# EAGLE design IMU_NoPilot (EAGLE 6.2)
AUTHOR: Kjell H Andersen; PROJECT_NAME: NoPilot; REVISION: 0.1

## Sheet 1 of 8: STM32 Power and Reset
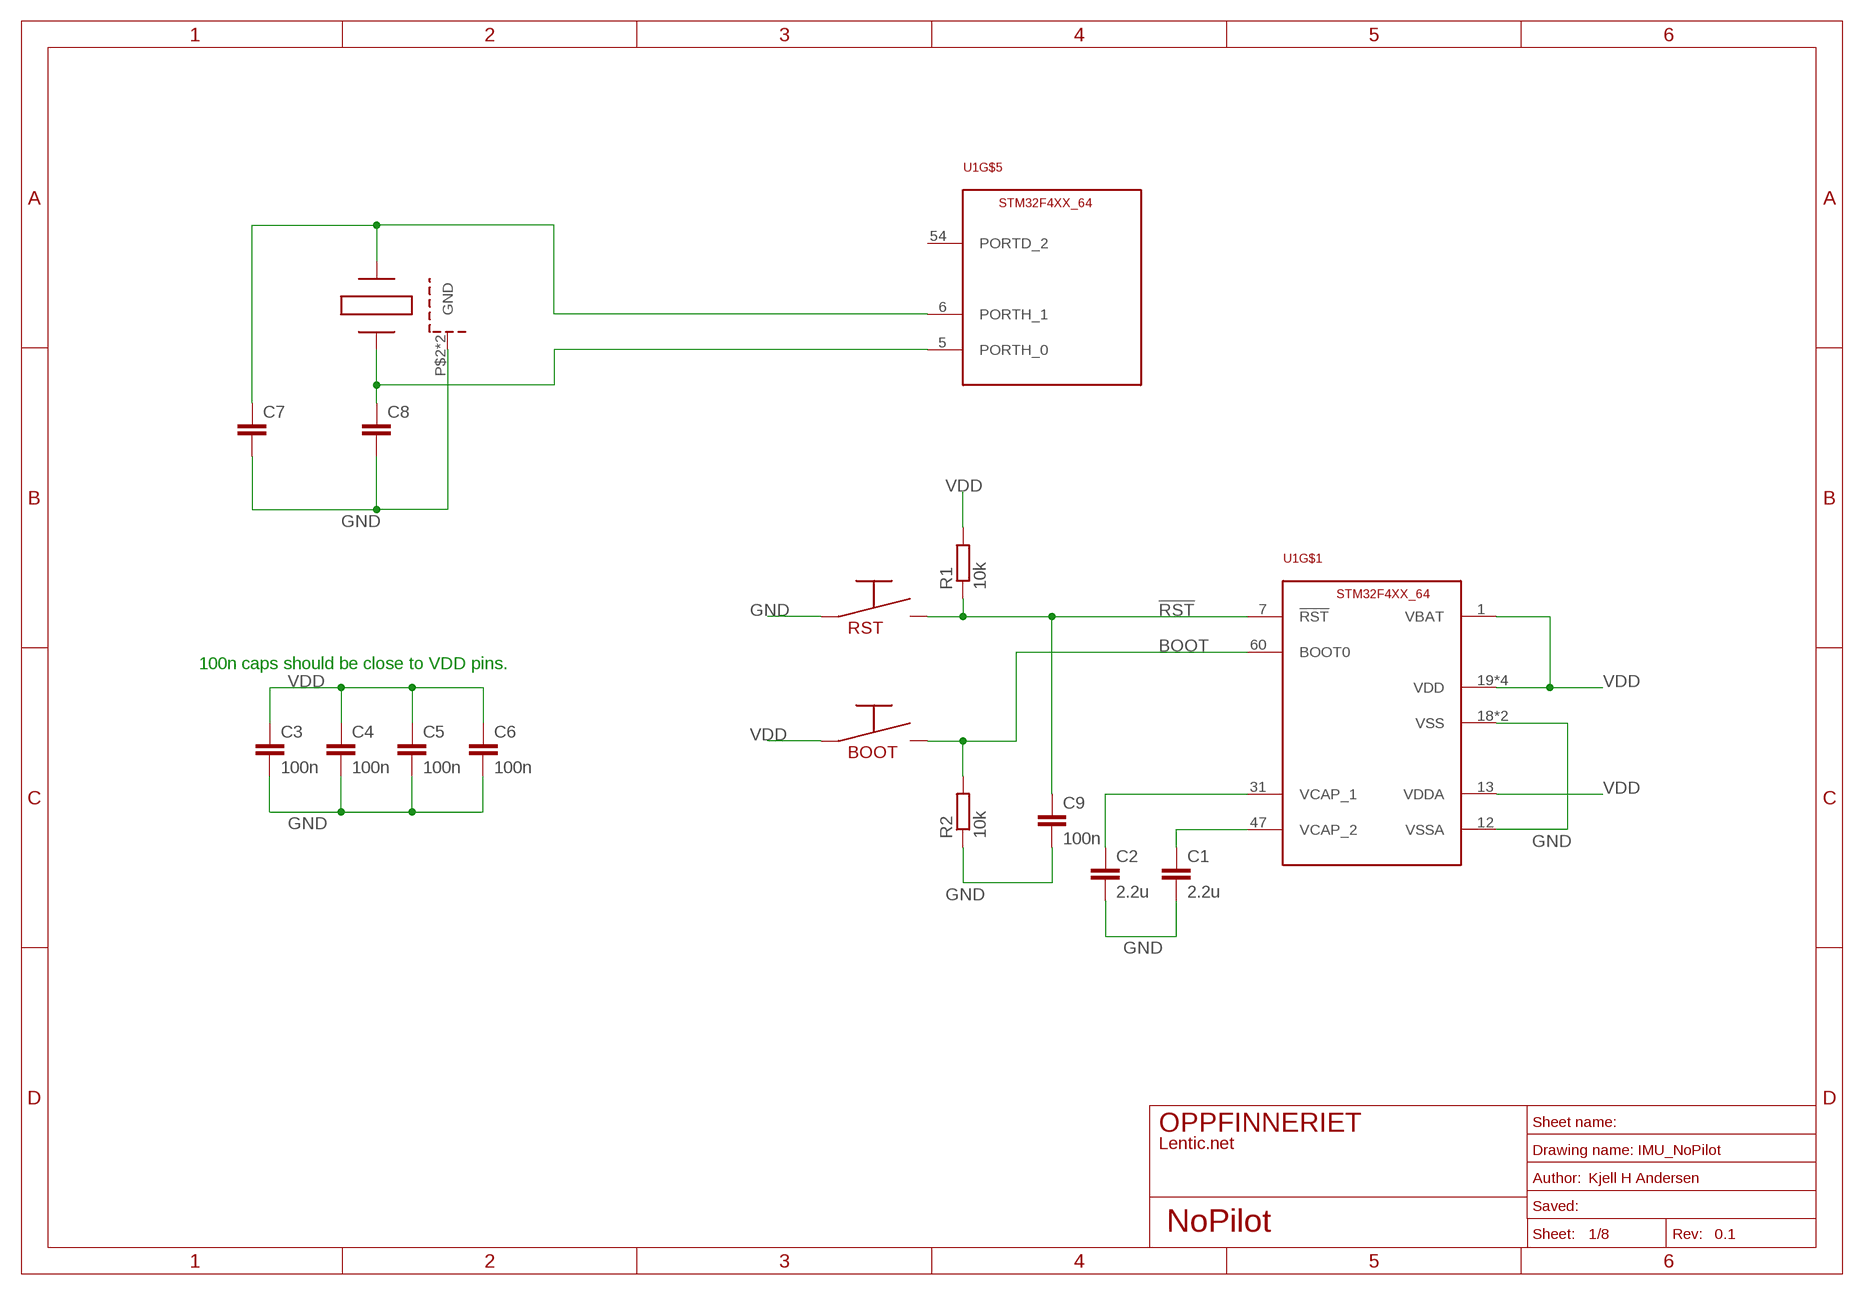
[diagram p0: schematic, sheet 1]
U$2 (A4_L): SHEET_NAME: stm32 Pwr/Rst

### Parts
BOOT  OMRON_B3FS_1000  [OMROM_B3FS-1XXX]
C1  2.2u  C-EUC0805  [C0805]
C2  2.2u  C-EUC0805  [C0805]
C3  100n  C-EUC0402  [C0402]
C4  100n  C-EUC0402  [C0402]
C5  100n  C-EUC0402  [C0402]
C6  100n  C-EUC0402  [C0402]
C7  C-EUC0402  [C0402]
C8  C-EUC0402  [C0402]
C9  100n  C-EUC0402  [C0402]
R1  10k  R-EU_R0402  [R0402]
R2  10k  R-EU_R0402  [R0402]
RST  OMRON_B3FS_1000  [OMROM_B3FS-1XXX]
U1  STM32F4XX_64  [TQFP64]
XTAL1  XTAL_5X3P2  [XTAL_5X3P2]

### Nets
!RST: C9.1 R1.1 RST.P3 RST.P4 U1.7(!RST) ; also sheet 3
BOOT: BOOT.P3 BOOT.P4 R2.2 U1.60(BOOT0)
GND [Power]: C1.2 C2.2 C3.2 C4.2 C5.2 C6.2 C7.2 C8.2 C9.2 R2.1 RST.P1 RST.P2 U1.12(VSSA) U1.18(VSS) U1.63(VSS) XTAL1.P$2(GND) XTAL1.P$4(GND) ; also sheet 2,3,4,5,6,7,8
N$1: C2.1 U1.31(VCAP_1)
N$2: C1.1 U1.47(VCAP_2)
N$4: C8.1 U1.5(PORTH_0) XTAL1.P$1(Q1)
N$6: C7.1 U1.6(PORTH_1) XTAL1.P$3(Q2)
VDD [Power]: BOOT.P1 BOOT.P2 C3.1 C4.1 C5.1 C6.1 R1.2 U1.1(VBAT) U1.13(VDDA) U1.19(VDD) U1.32(VDD) U1.48(VDD) U1.64(VDD) ; also sheet 3,4,5,6,7,8
Unconnected: U1.54(PORTD_2)

### Notes on the sheet
- 100n caps should be close to VDD pins.

## Sheet 2 of 8: STM32 IO ports
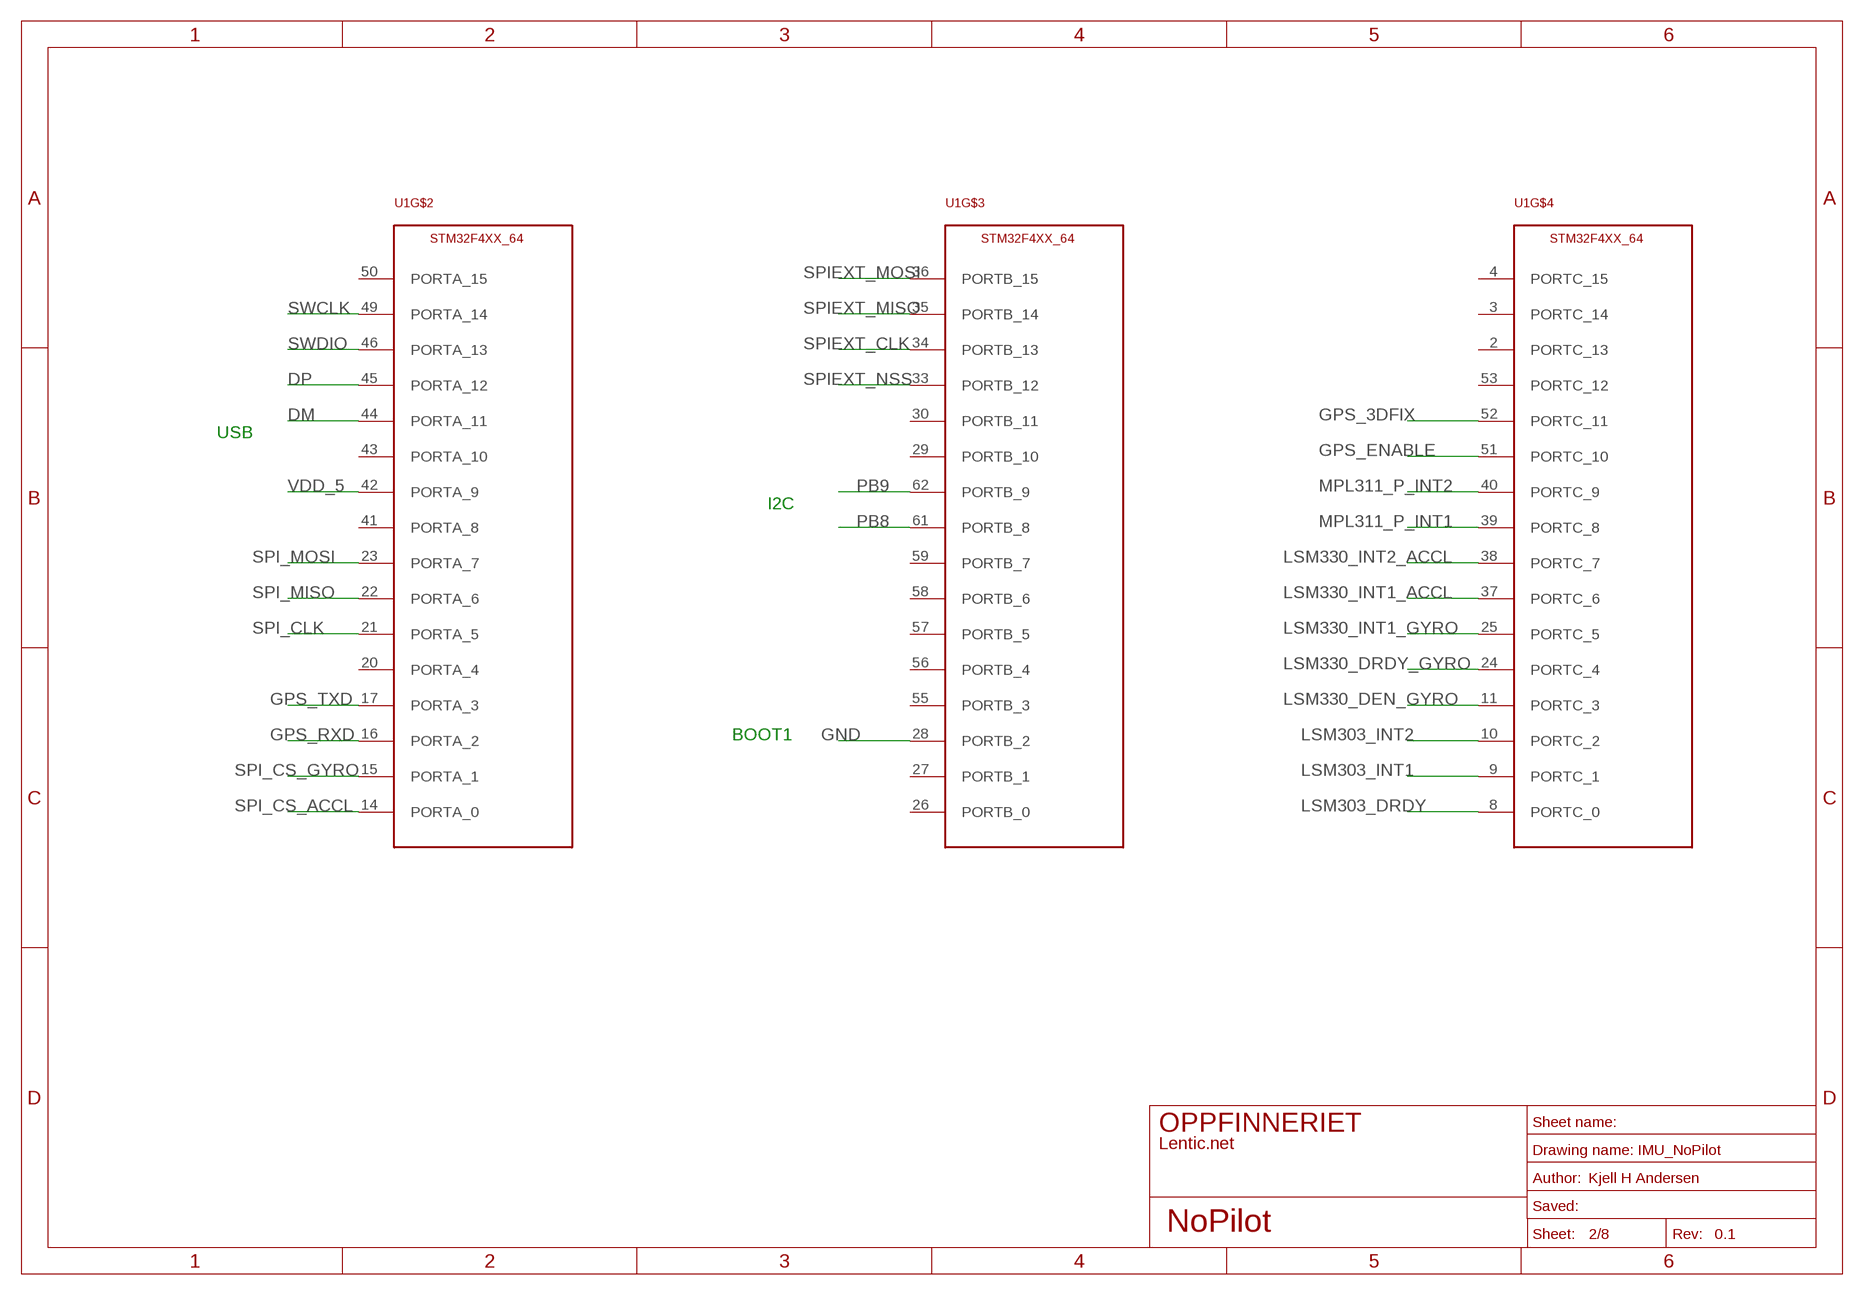
[diagram p1: schematic, sheet 2]
U$3 (A4_L): SHEET_NAME: STM32 IO Ports

### Nets
DM: U1.44(PORTA_11) ; also sheet 3
DP: U1.45(PORTA_12) ; also sheet 3
GND [Power]: U1.28(PORTB_2) ; also sheet 1,3,4,5,6,7,8
GPS_3DFIX: U1.52(PORTC_11) ; also sheet 7
GPS_ENABLE: U1.51(PORTC_10) ; also sheet 7
GPS_RXD: U1.16(PORTA_2) ; also sheet 7
GPS_TXD: U1.17(PORTA_3) ; also sheet 7
LSM303_DRDY: U1.8(PORTC_0) ; also sheet 4
LSM303_INT1: U1.9(PORTC_1) ; also sheet 4
LSM303_INT2: U1.10(PORTC_2) ; also sheet 4
LSM330_DEN_GYRO: U1.11(PORTC_3) ; also sheet 5
LSM330_DRDY_GYRO: U1.24(PORTC_4) ; also sheet 5
LSM330_INT1_ACCL: U1.37(PORTC_6) ; also sheet 5
LSM330_INT1_GYRO: U1.25(PORTC_5) ; also sheet 5
LSM330_INT2_ACCL: U1.38(PORTC_7) ; also sheet 5
MPL311_P_INT1: U1.39(PORTC_8) ; also sheet 6
MPL311_P_INT2: U1.40(PORTC_9) ; also sheet 6
PB8: U1.61(PORTB_8) ; also sheet 3
PB9: U1.62(PORTB_9) ; also sheet 3
SPI_CLK: U1.21(PORTA_5) ; also sheet 5
SPI_CS_ACCL: U1.14(PORTA_0) ; also sheet 5
SPI_CS_GYRO: U1.15(PORTA_1) ; also sheet 5
SPI_MISO: U1.22(PORTA_6) ; also sheet 5
SPI_MOSI: U1.23(PORTA_7) ; also sheet 5
SPIEXT_CLK: U1.34(PORTB_13) ; also sheet 3
SPIEXT_MISO: U1.35(PORTB_14) ; also sheet 3
SPIEXT_MOSI: U1.36(PORTB_15) ; also sheet 3
SPIEXT_NSS: U1.33(PORTB_12) ; also sheet 3
SWCLK: U1.49(PORTA_14) ; also sheet 3
SWDIO: U1.46(PORTA_13) ; also sheet 3
VDD_5 [Power]: U1.42(PORTA_9) ; also sheet 3,8
Unconnected: U1.2(PORTC_13) U1.3(PORTC_14) U1.4(PORTC_15) U1.20(PORTA_4) U1.26(PORTB_0) U1.27(PORTB_1) U1.29(PORTB_10) U1.30(PORTB_11) U1.41(PORTA_8) U1.43(PORTA_10) U1.50(PORTA_15) U1.53(PORTC_12) U1.55(PORTB_3) U1.56(PORTB_4) U1.57(PORTB_5) U1.58(PORTB_6) U1.59(PORTB_7)

### Notes on the sheet
- USB
- I2C
- BOOT1

## Sheet 3 of 8: Interfaces
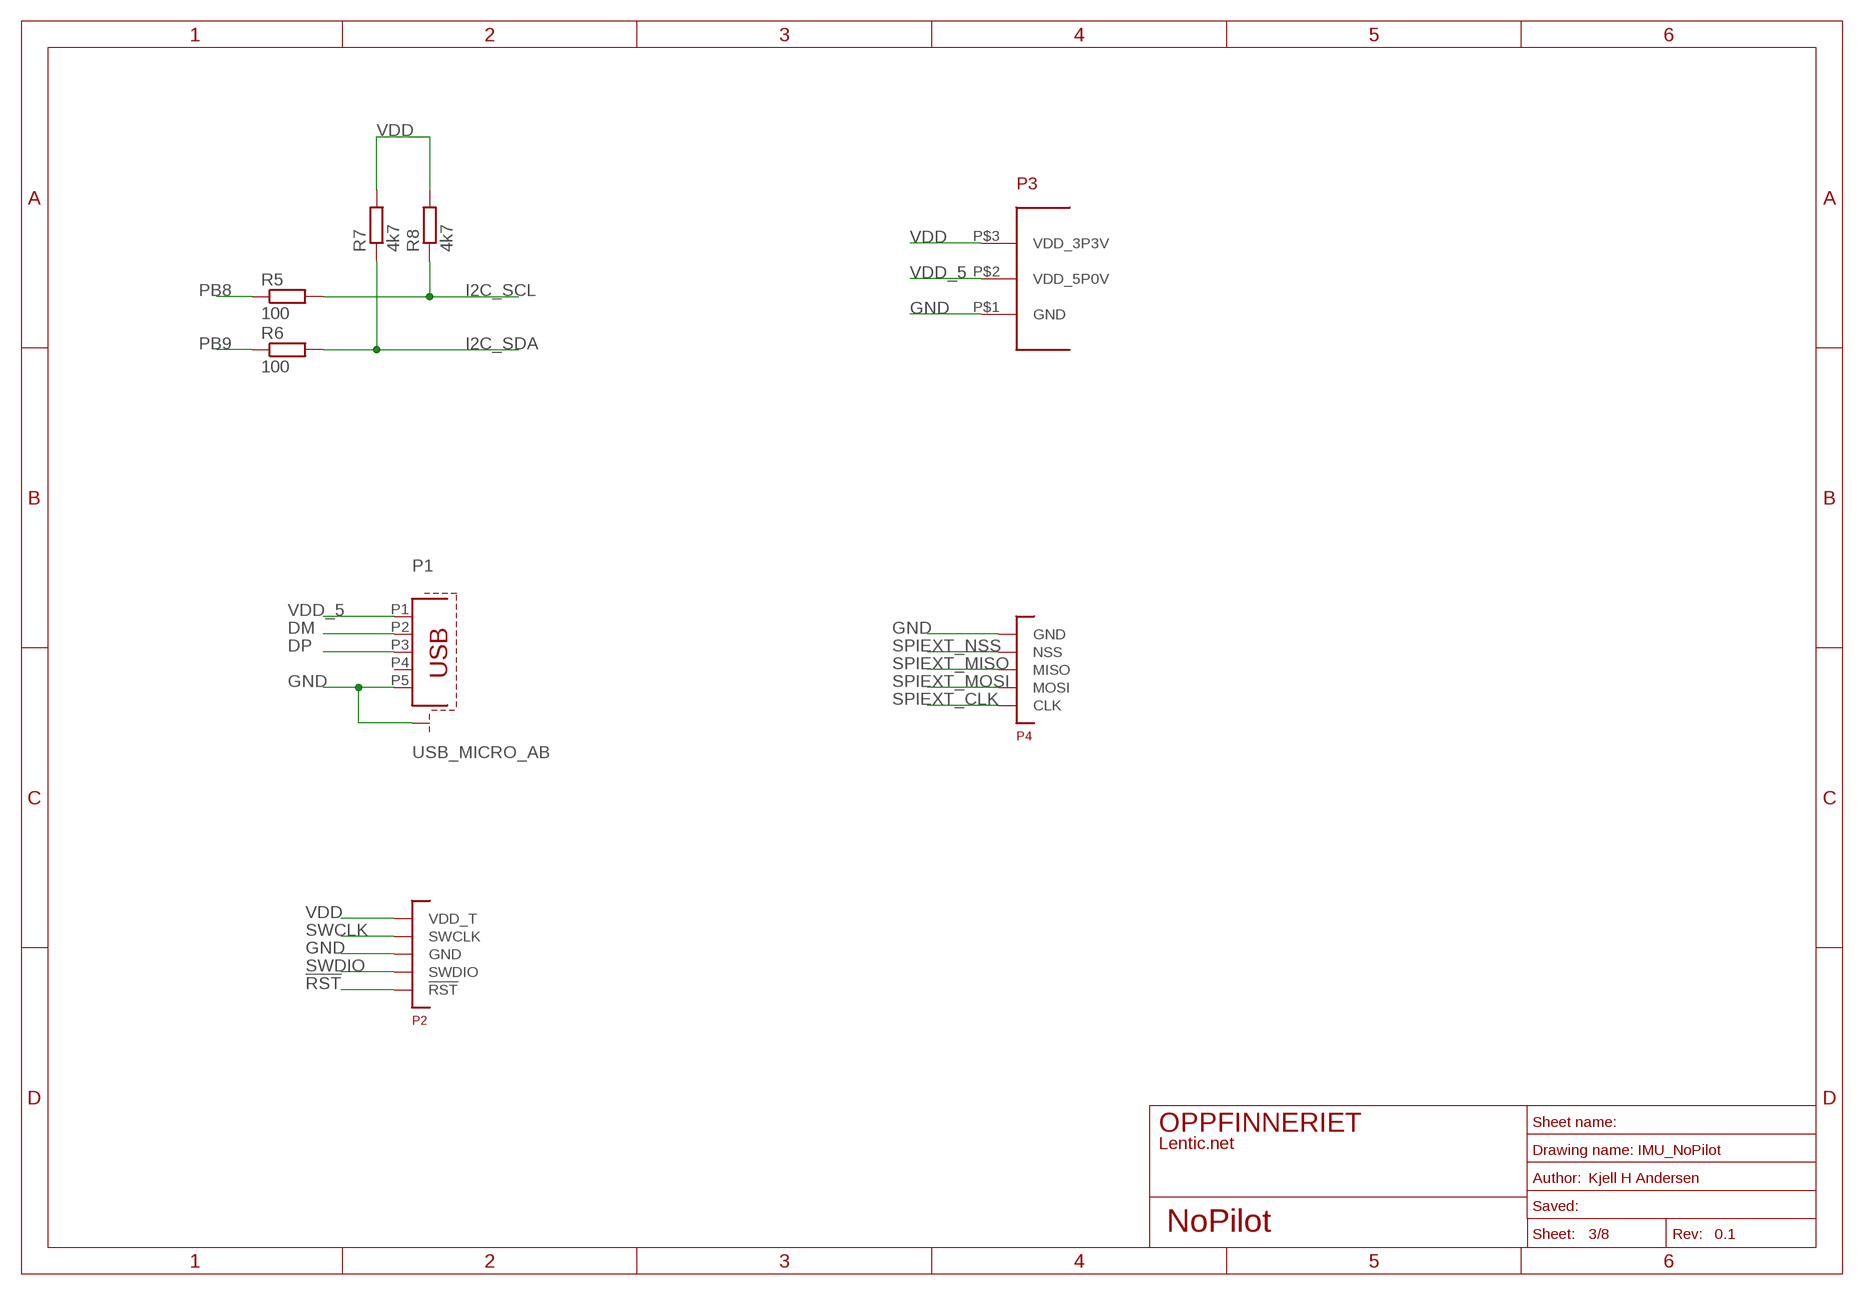
[diagram p2: schematic, sheet 3]
U$5 (A4_L): SHEET_NAME: Interfaces

### Parts
P1  USB_MICRO_AB  [USB_MICRO_AB]
P2  ST_LINK  [ST_LINK]
P3  PWR3  [PWR3]
P4  SPI_EXT  [PINLIST5_2P54]
R5  100  R-EU_R0402  [R0402]
R6  100  R-EU_R0402  [R0402]
R7  4k7  R-EU_R0402  [R0402]
R8  4k7  R-EU_R0402  [R0402]

### Nets
!RST: P2.P$5(!RST) ; also sheet 1
DM: P1.P2 ; also sheet 2
DP: P1.P3 ; also sheet 2
GND [Power]: P1.NC1(S1) P1.NC2(S1) P1.NC3(S1) P1.NC4(S1) P1.NC5(S1) P1.NC6(S1) P1.P5 P2.P$3(GND) P3.P$1(GND) P4.P$5(GND) ; also sheet 1,2,4,5,6,7,8
I2C_SCL: R5.2 R8.1 ; also sheet 4,6
I2C_SDA: R6.2 R7.1 ; also sheet 4,6
PB8: R5.1 ; also sheet 2
PB9: R6.1 ; also sheet 2
SPIEXT_CLK: P4.P$1(CLK) ; also sheet 2
SPIEXT_MISO: P4.P$3(MISO) ; also sheet 2
SPIEXT_MOSI: P4.P$2(MOSI) ; also sheet 2
SPIEXT_NSS: P4.P$4(NSS) ; also sheet 2
SWCLK: P2.P$2(SWCLK) ; also sheet 2
SWDIO: P2.P$4(SWDIO) ; also sheet 2
VDD [Power]: P2.P$1(VDD_T) P3.P$3(VDD_3P3V) R7.2 R8.2 ; also sheet 1,4,5,6,7,8
VDD_5 [Power]: P1.P1 P3.P$2(VDD_5P0V) ; also sheet 2,8
Unconnected: P1.P4

## Sheet 4 of 8: Accelerometer and Magnetometer
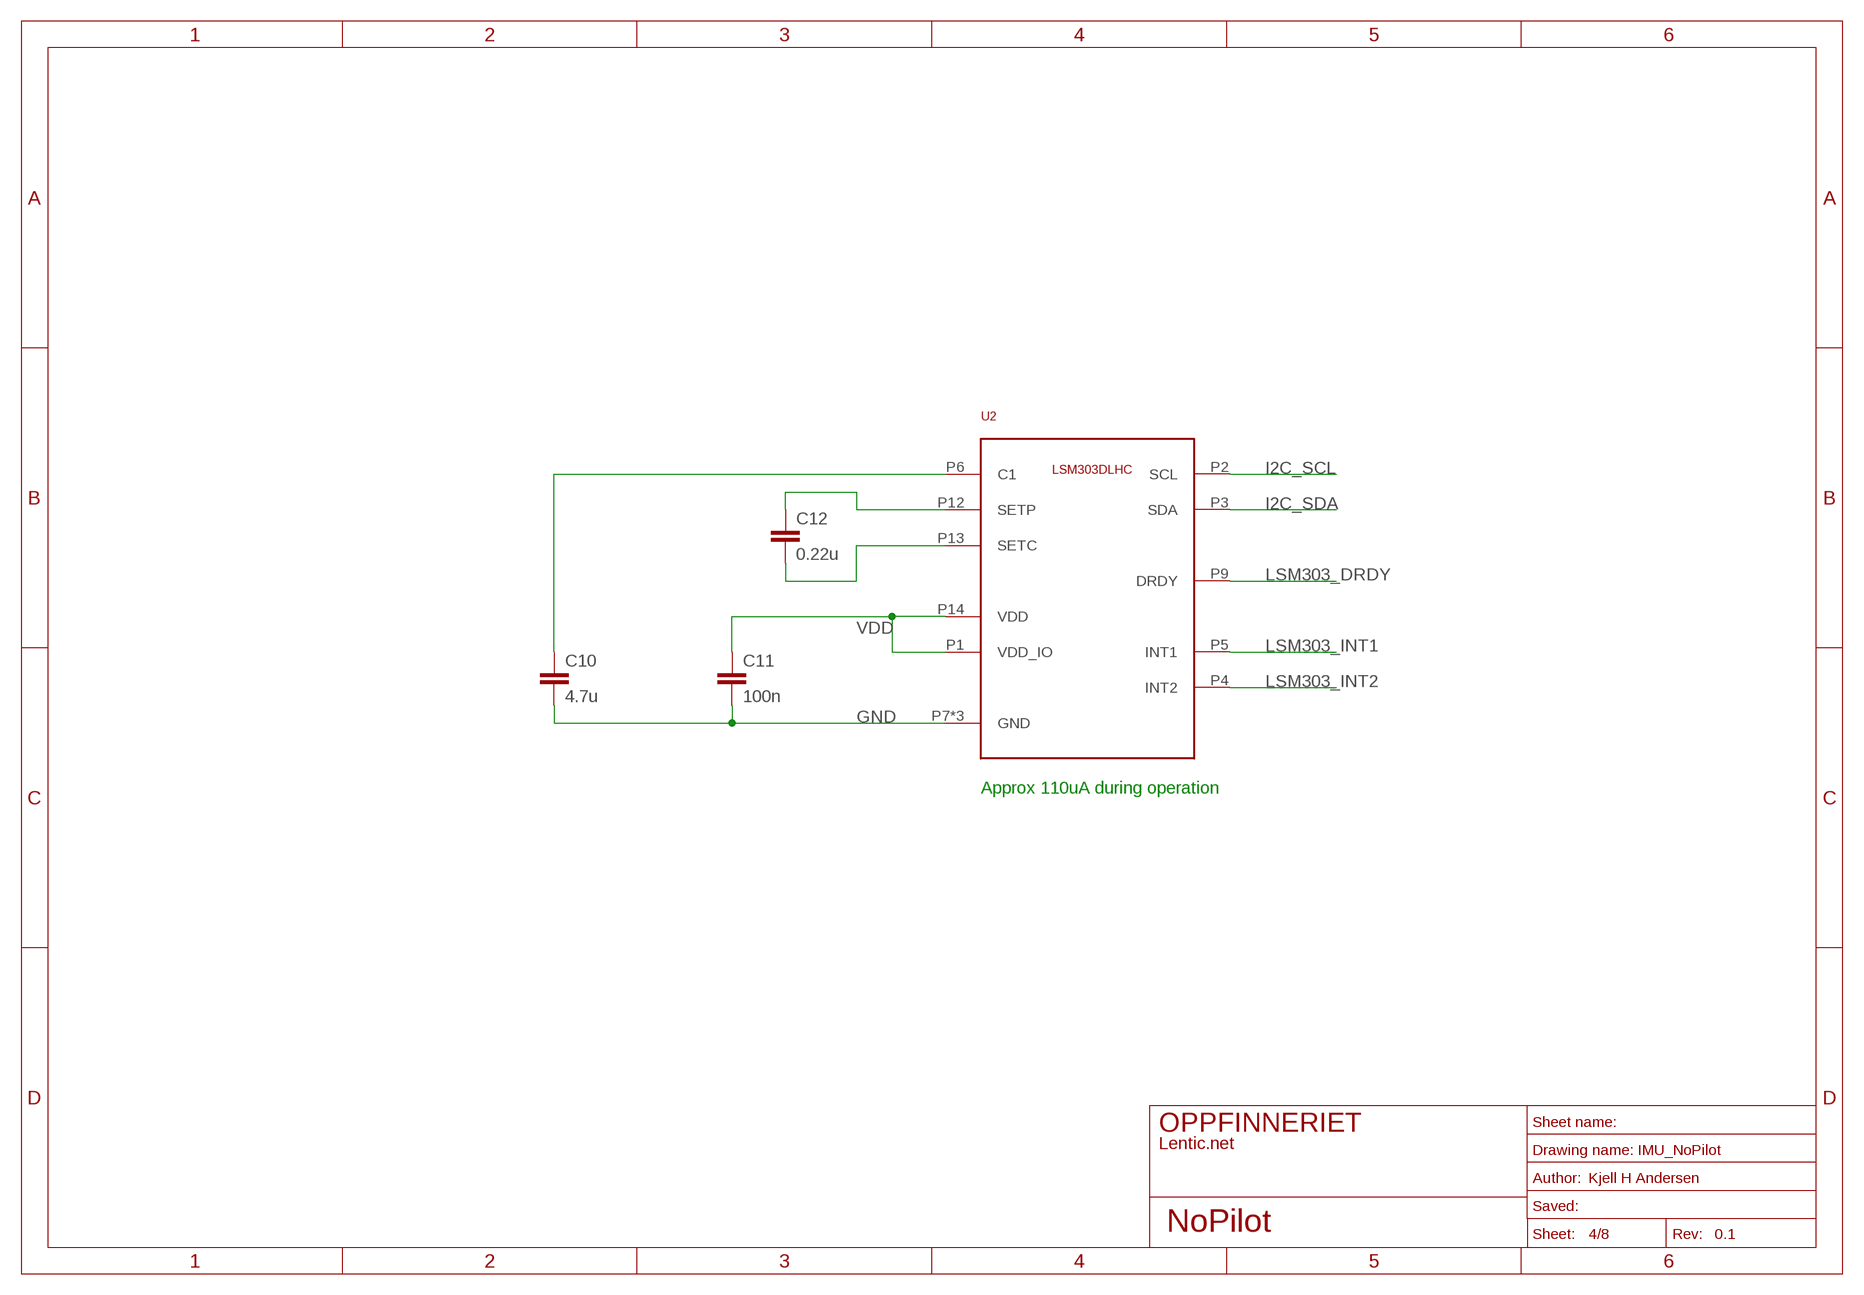
[diagram p3: schematic, sheet 4]
U$8 (A4_L): SHEET_NAME: Accl / Mag

### Parts
C10  4.7u  C-EUC0805  [C0805]
C11  100n  C-EUC0402  [C0402]
C12  0.22u  C-EUC0402  [C0402]
U2  LSM303DLHC  [LGA_3X5X1_14L]

### Nets
GND [Power]: C10.2 C11.2 U2.P7(GND) U2.P10(GND) U2.P11(GND) ; also sheet 1,2,3,5,6,7,8
I2C_SCL: U2.P2(SCL) ; also sheet 3,6
I2C_SDA: U2.P3(SDA) ; also sheet 3,6
LSM303_DRDY: U2.P9(DRDY) ; also sheet 2
LSM303_INT1: U2.P5(INT1) ; also sheet 2
LSM303_INT2: U2.P4(INT2) ; also sheet 2
N$3: C12.1 U2.P12(SETP)
N$5: C12.2 U2.P13(SETC)
N$9: C10.1 U2.P6(C1)
VDD [Power]: C11.1 U2.P1(VDD_IO) U2.P14(VDD) ; also sheet 1,3,5,6,7,8

### Notes on the sheet
- Approx 110uA during operation

## Sheet 5 of 8: Gyroscope
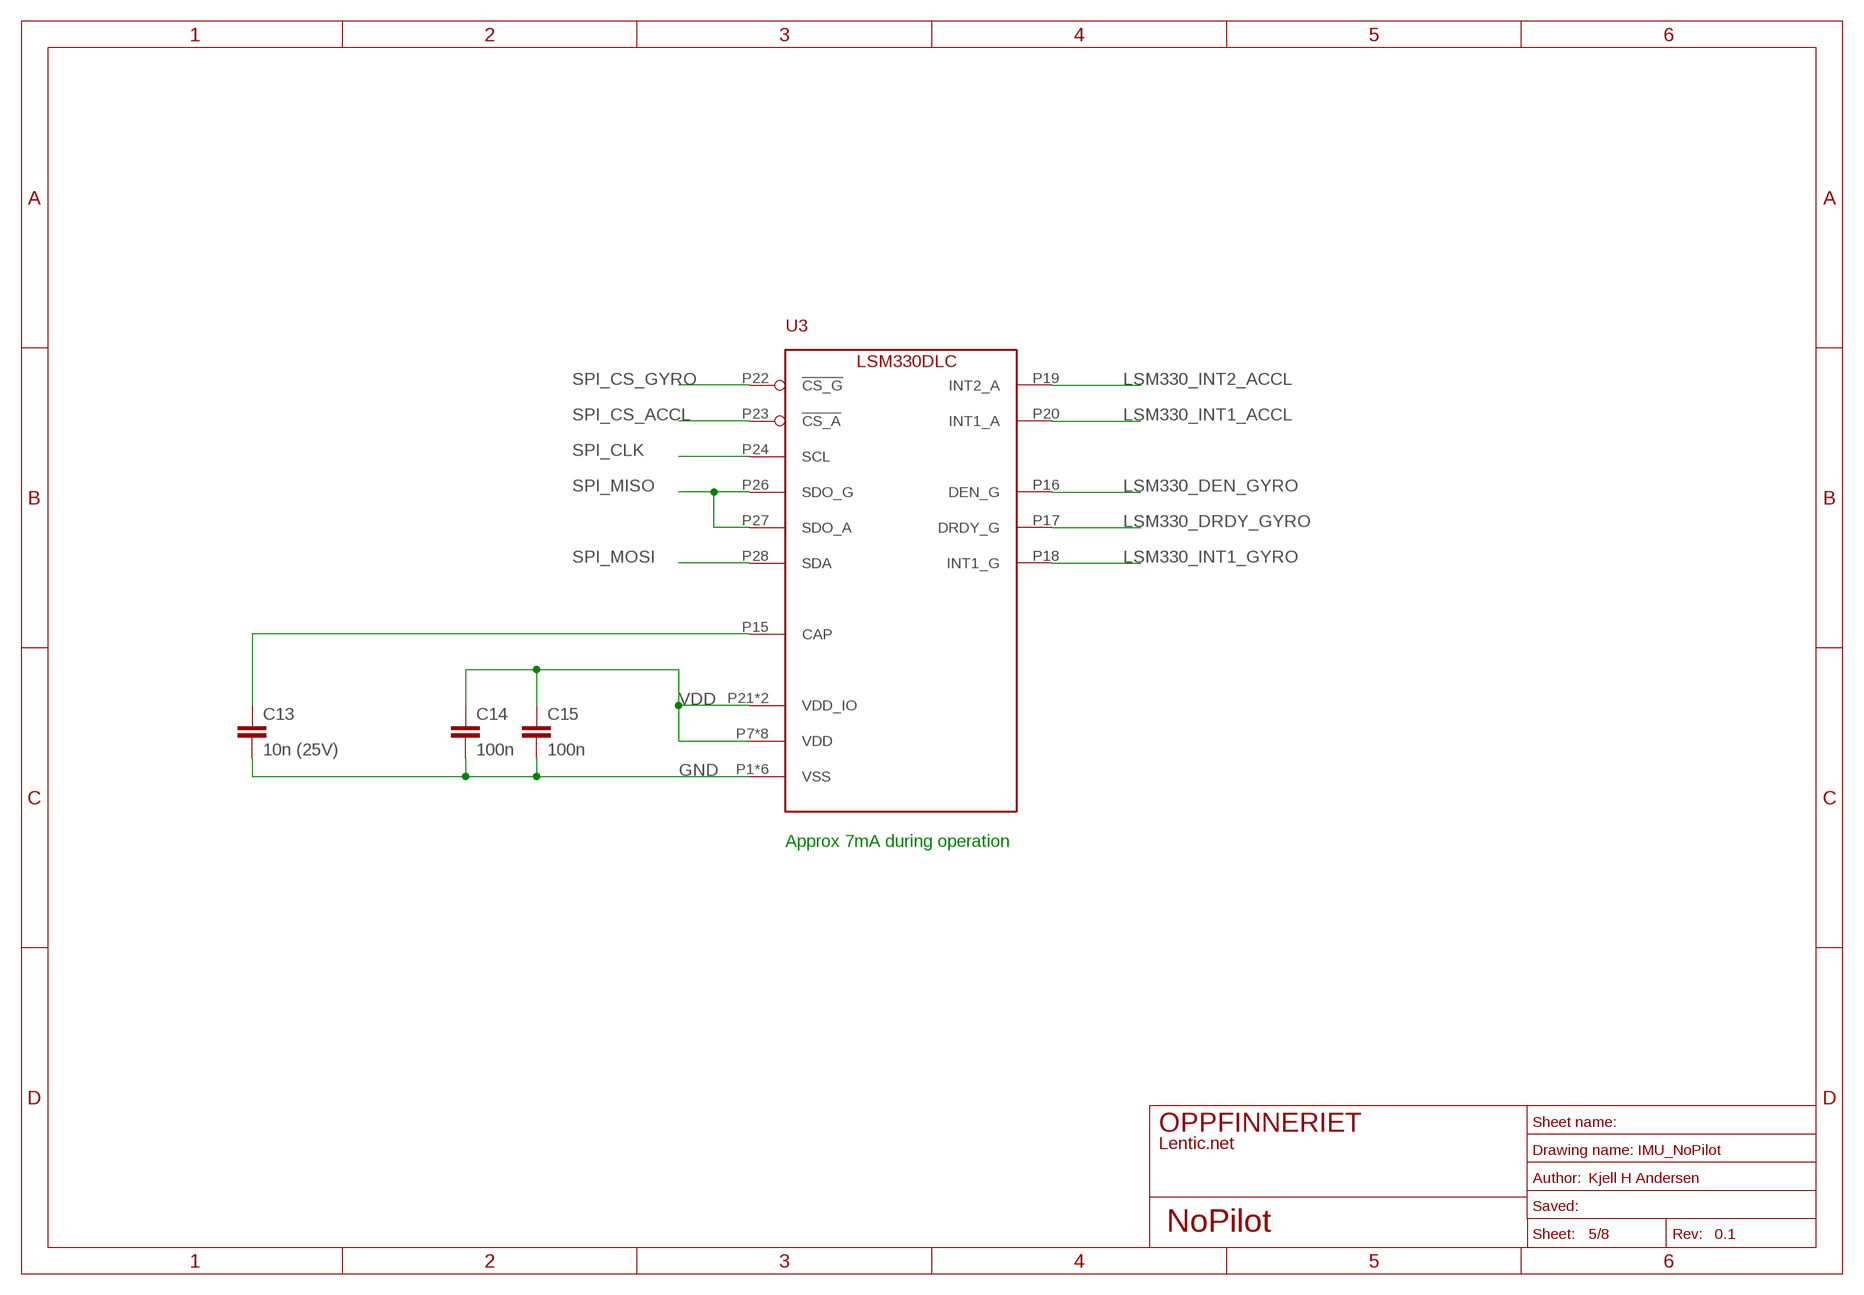
[diagram p4: schematic, sheet 5]
U$9 (A4_L): SHEET_NAME: Gyro

### Parts
C13  10n (25V)  C-EUC0402  [C0402]
C14  100n  C-EUC0402  [C0402]
C15  100n  C-EUC0402  [C0402]
U3  LSM330DLC  [LGA_4X5X1P1_28L]

### Nets
GND [Power]: C13.2 C14.2 C15.2 U3.P1(VSS) U3.P2(VSS) U3.P3(VSS) U3.P4(VSS) U3.P5(VSS) U3.P6(VSS) ; also sheet 1,2,3,4,6,7,8
LSM330_DEN_GYRO: U3.P16(DEN_G) ; also sheet 2
LSM330_DRDY_GYRO: U3.P17(DRDY_G) ; also sheet 2
LSM330_INT1_ACCL: U3.P20(INT1_A) ; also sheet 2
LSM330_INT1_GYRO: U3.P18(INT1_G) ; also sheet 2
LSM330_INT2_ACCL: U3.P19(INT2_A) ; also sheet 2
N$10: C13.1 U3.P15(CAP)
SPI_CLK: U3.P24(SCL) ; also sheet 2
SPI_CS_ACCL: U3.P23(!CS_A) ; also sheet 2
SPI_CS_GYRO: U3.P22(!CS_G) ; also sheet 2
SPI_MISO: U3.P26(SDO_G) U3.P27(SDO_A) ; also sheet 2
SPI_MOSI: U3.P28(SDA) ; also sheet 2
VDD [Power]: C14.1 C15.1 U3.P7(VDD) U3.P8(VDD) U3.P9(VDD) U3.P10(VDD) U3.P11(VDD) U3.P12(VDD) U3.P13(VDD) U3.P14(VDD) U3.P21(VDD_IO) U3.P25(VDD_IO) ; also sheet 1,3,4,6,7,8

### Notes on the sheet
- Approx 7mA during operation

## Sheet 6 of 8: Pressure sensor
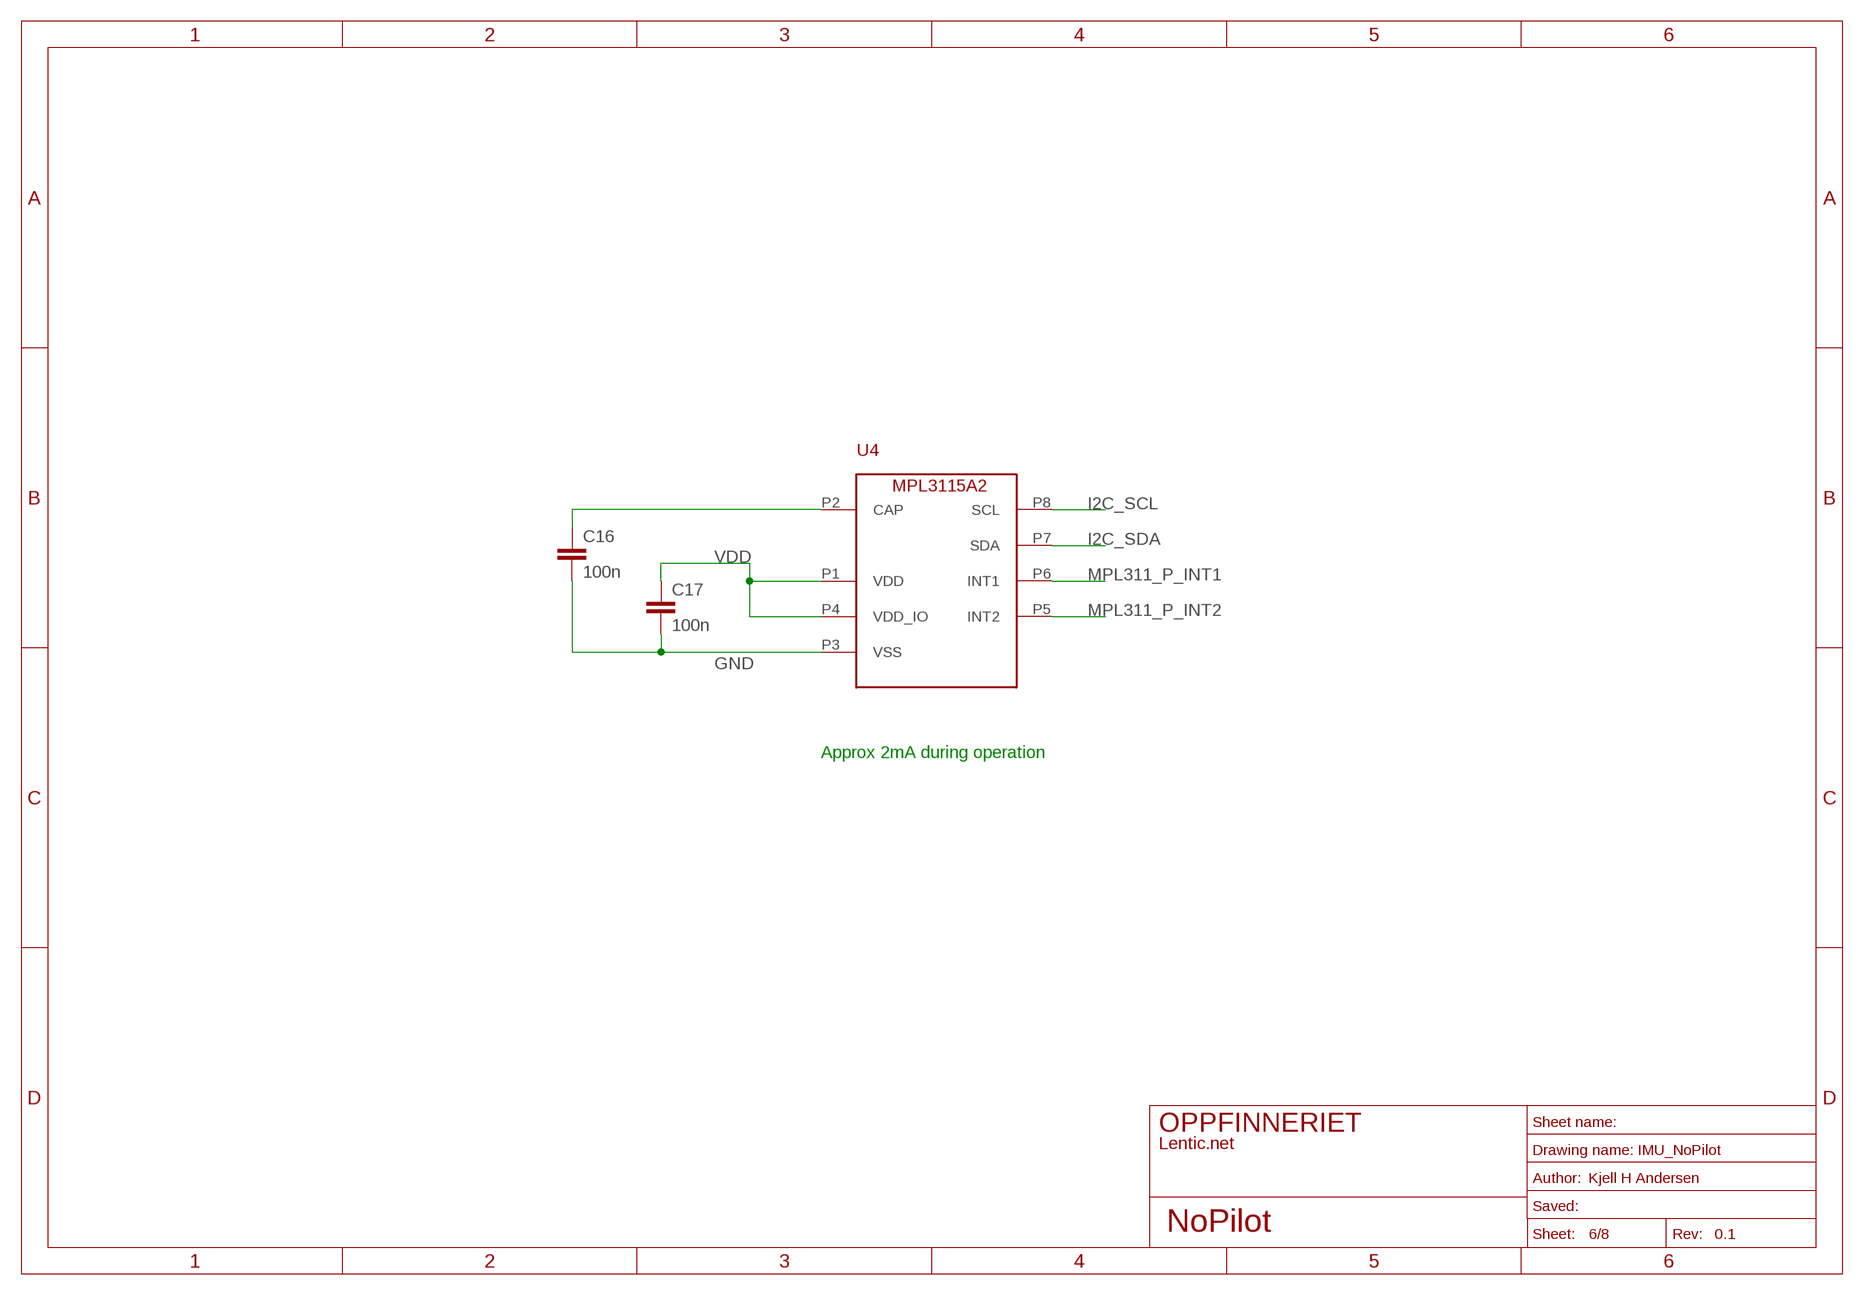
[diagram p5: schematic, sheet 6]
U$10 (A4_L): SHEET_NAME: Pressure

### Parts
C16  100n  C-EUC0402  [C0402]
C17  100n  C-EUC0402  [C0402]
U4  MPL3115A2  [LGA_3X5_8]

### Nets
GND [Power]: C16.2 C17.2 U4.P3(VSS) ; also sheet 1,2,3,4,5,7,8
I2C_SCL: U4.P8(SCL) ; also sheet 3,4
I2C_SDA: U4.P7(SDA) ; also sheet 3,4
MPL311_P_INT1: U4.P6(INT1) ; also sheet 2
MPL311_P_INT2: U4.P5(INT2) ; also sheet 2
N$11: C16.1 U4.P2(CAP)
VDD [Power]: C17.1 U4.P1(VDD) U4.P4(VDD_IO) ; also sheet 1,3,4,5,7,8

### Notes on the sheet
- Approx 2mA during operation

## Sheet 7 of 8: GPS
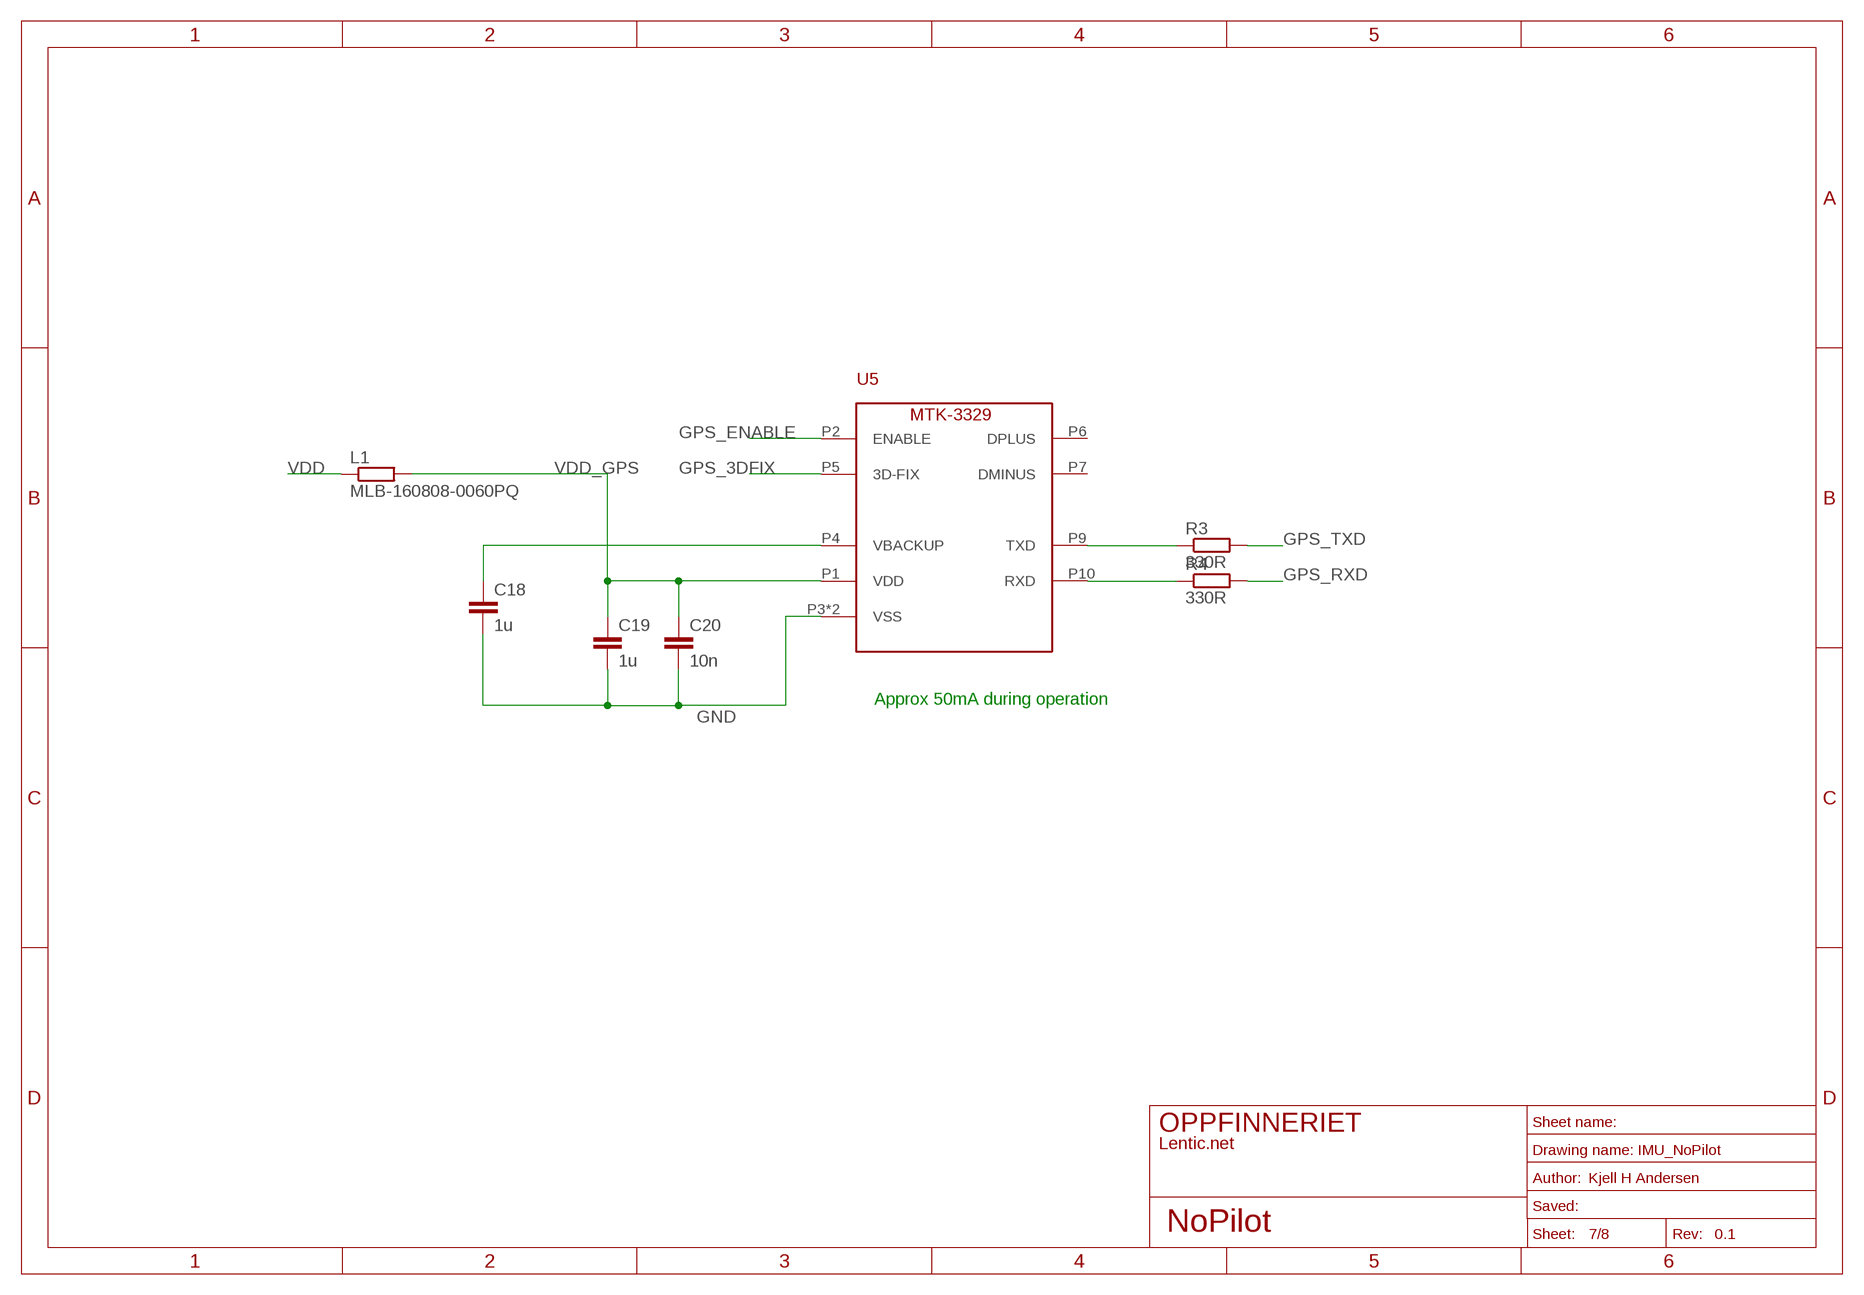
[diagram p6: schematic, sheet 7]
U$11 (A4_L): SHEET_NAME: GPS

### Parts
C18  1u  C-EUC0805  [C0805]
C19  1u  C-EUC0805  [C0805]
C20  10n  C-EUC0402  [C0402]
L1  MLB-160808-0060PQ  R-EU_R0603  [R0603]
R3  330R  R-EU_R0402  [R0402]
R4  330R  R-EU_R0402  [R0402]
U5  MTK-3329  [MTK-3329]

### Nets
GND [Power]: C18.2 C19.2 C20.2 U5.P3(VSS) U5.P8(VSS) ; also sheet 1,2,3,4,5,6,8
GPS_3DFIX: U5.P5(3D-FIX) ; also sheet 2
GPS_ENABLE: U5.P2(ENABLE) ; also sheet 2
GPS_RXD: R4.2 ; also sheet 2
GPS_TXD: R3.2 ; also sheet 2
N$14: R3.1 U5.P9(TXD)
N$15: R4.1 U5.P10(RXD)
N$18: C18.1 U5.P4(VBACKUP)
VDD [Power]: L1.1 ; also sheet 1,3,4,5,6,8
VDD_GPS [Power]: C19.1 C20.1 L1.2 U5.P1(VDD)
Unconnected: U5.P6(DPLUS) U5.P7(DMINUS)

### Notes on the sheet
- Approx 50mA during operation

## Sheet 8 of 8: Power supply
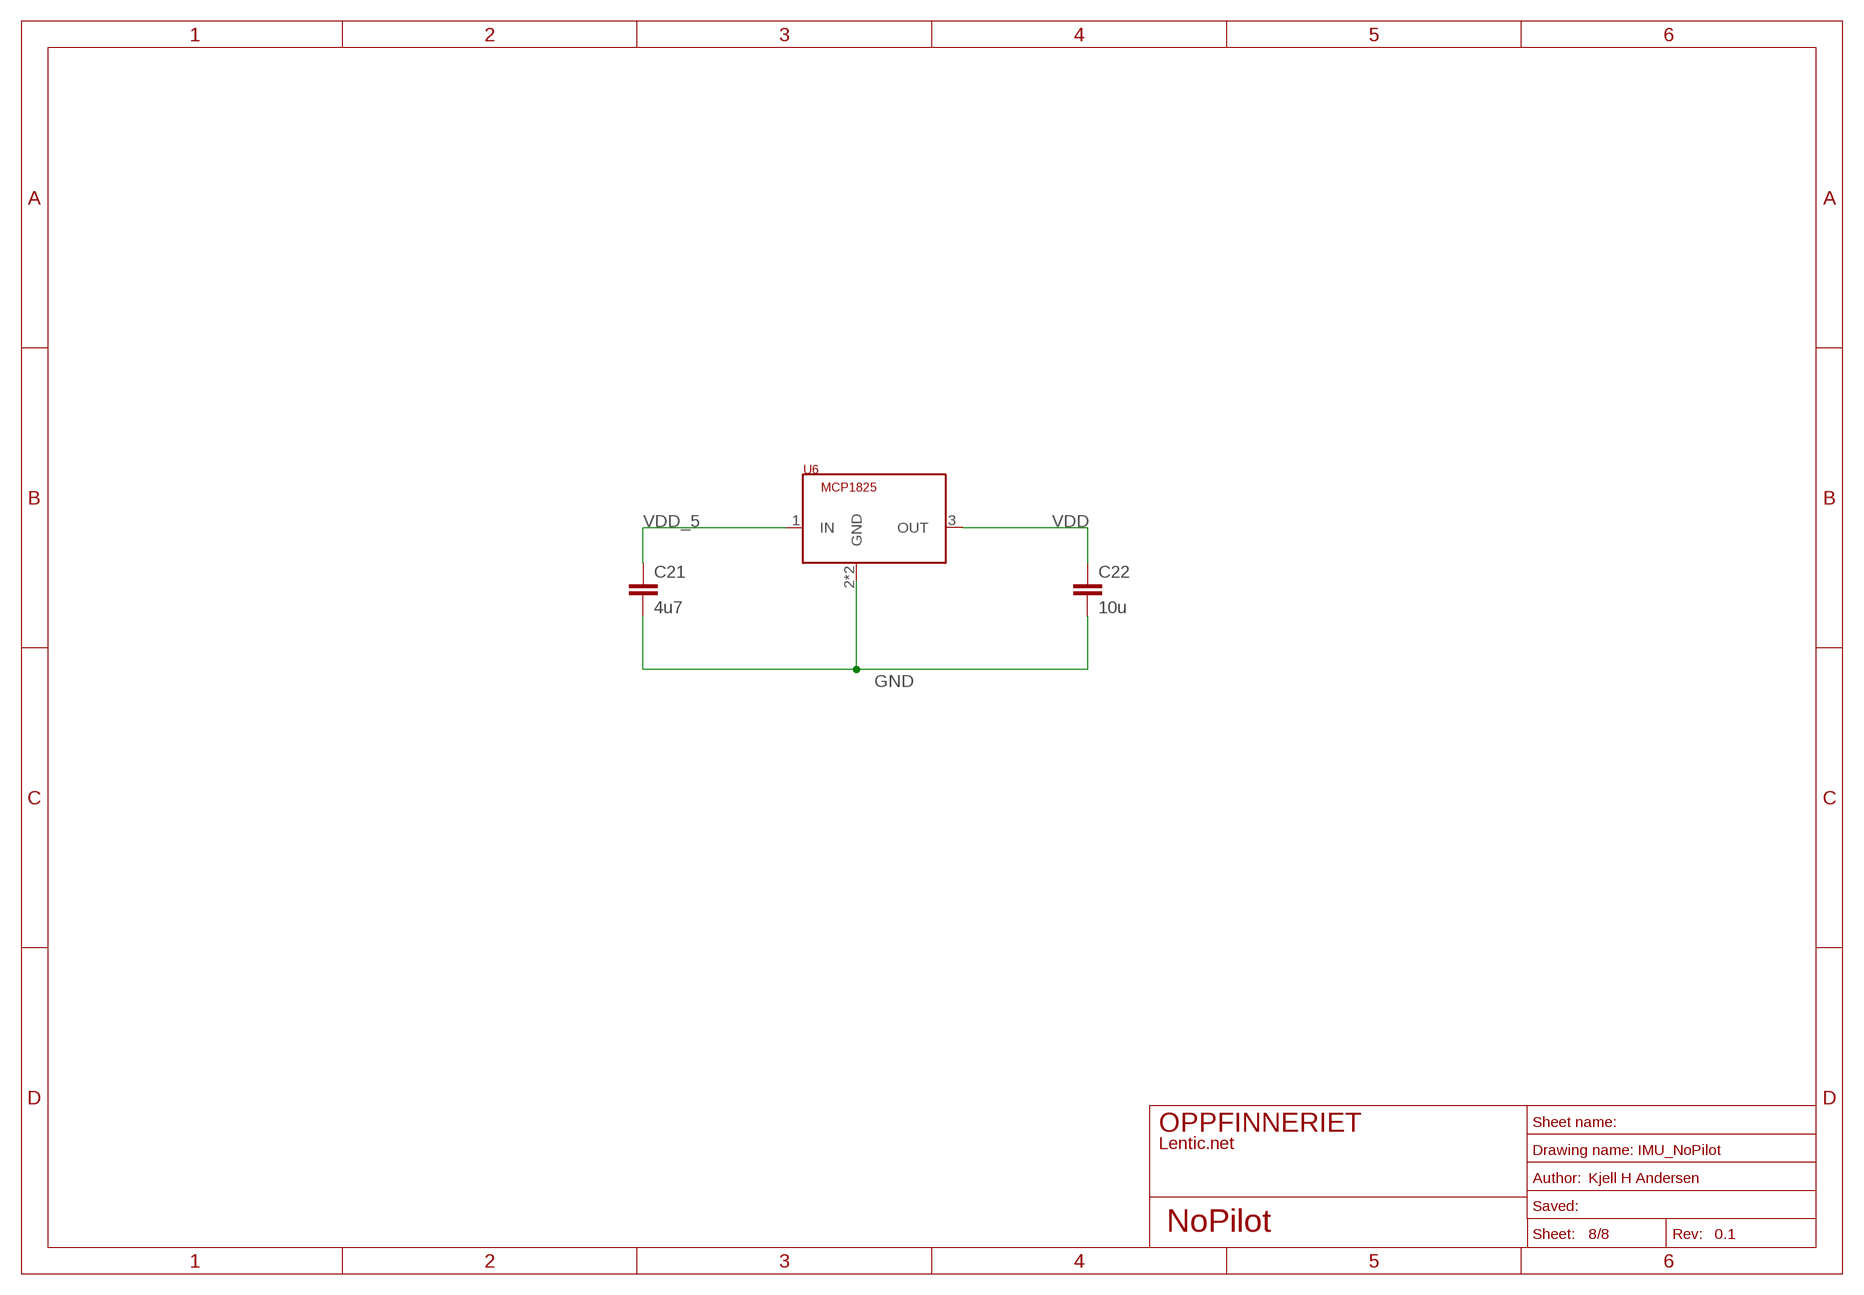
[diagram p7: schematic, sheet 8]
U$16 (A4_L): SHEET_NAME: Power

### Parts
C21  4u7  C-EUC0805  [C0805]
C22  10u  C-EUC0805  [C0805]
U6  MCP1825  [SOT223]

### Nets
GND [Power]: C21.2 C22.2 U6.2(GND) U6.4(GND) ; also sheet 1,2,3,4,5,6,7
VDD [Power]: C22.1 U6.3(OUT) ; also sheet 1,3,4,5,6,7
VDD_5 [Power]: C21.1 U6.1(IN) ; also sheet 2,3

## Library data of the parts
BOOT RST = misc_devices:OMRON_B3FS_1000
C1-C22 = resistor:C-EU: CAPACITOR, European symbol
L1 R1-R8 = resistor:R-EU_: RESISTOR, European symbol
P1 = connectors:USB_MICRO_AB
P2 = connectors:ST_LINK
P3 = connectors:PWR3
P4 = connectors:SPI_EXT
U1 = stm32:STM32F4XX_64
U2 = sensors:LSM303DLHC
U3 = sensors:LSM330DLC
U4 = sensors:MPL3115A2
U5 = sensors:MTK-3329
U6 = misc_devices:MCP1825
XTAL1 = misc_devices:XTAL_5X3P2

## Net classes
1 Power: width 0.3 mm

## Board
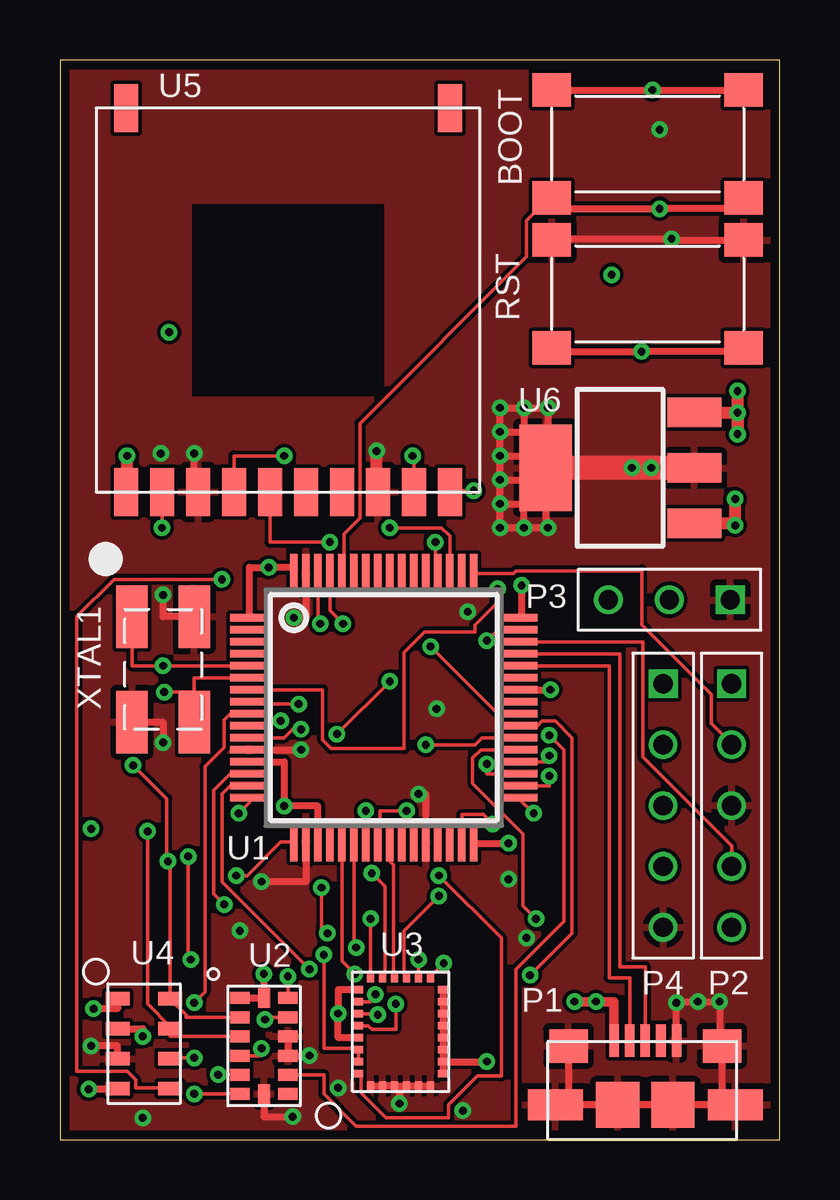
[diagram p8: board, top side]
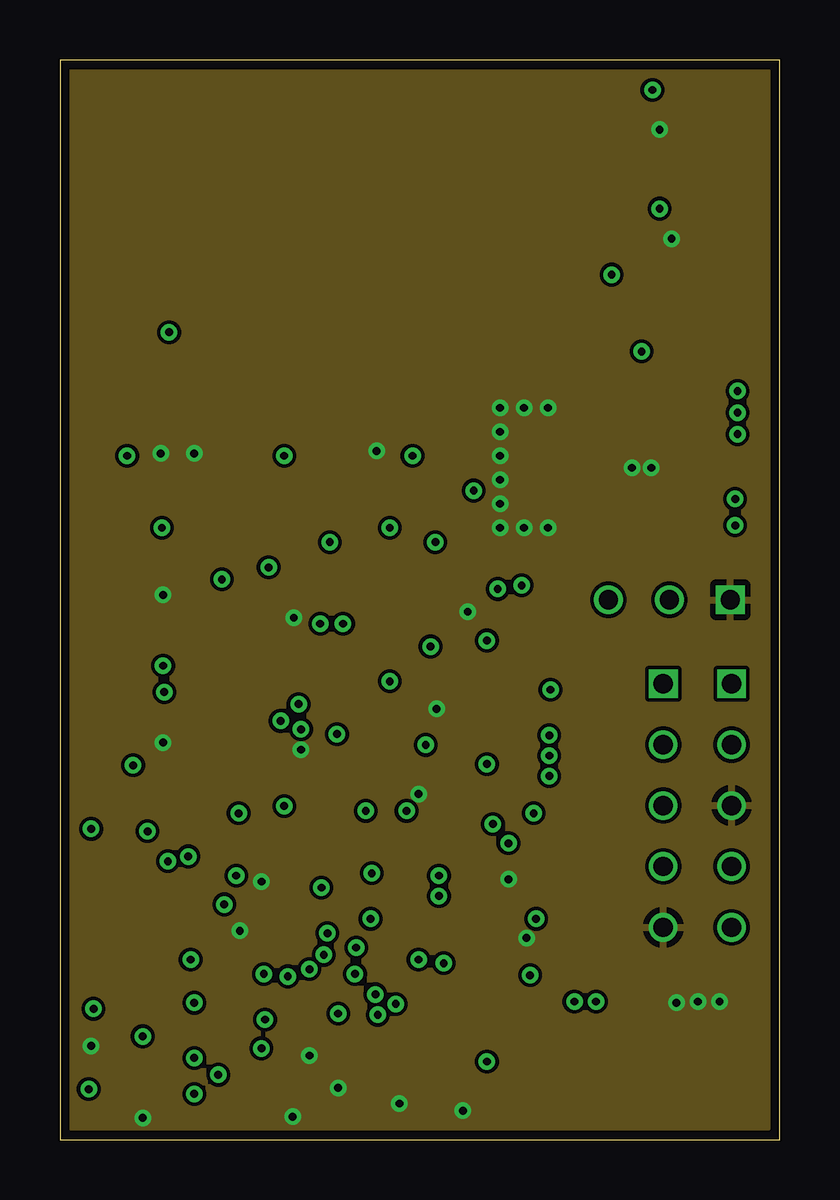
[diagram p9: board, inner layer Route2]
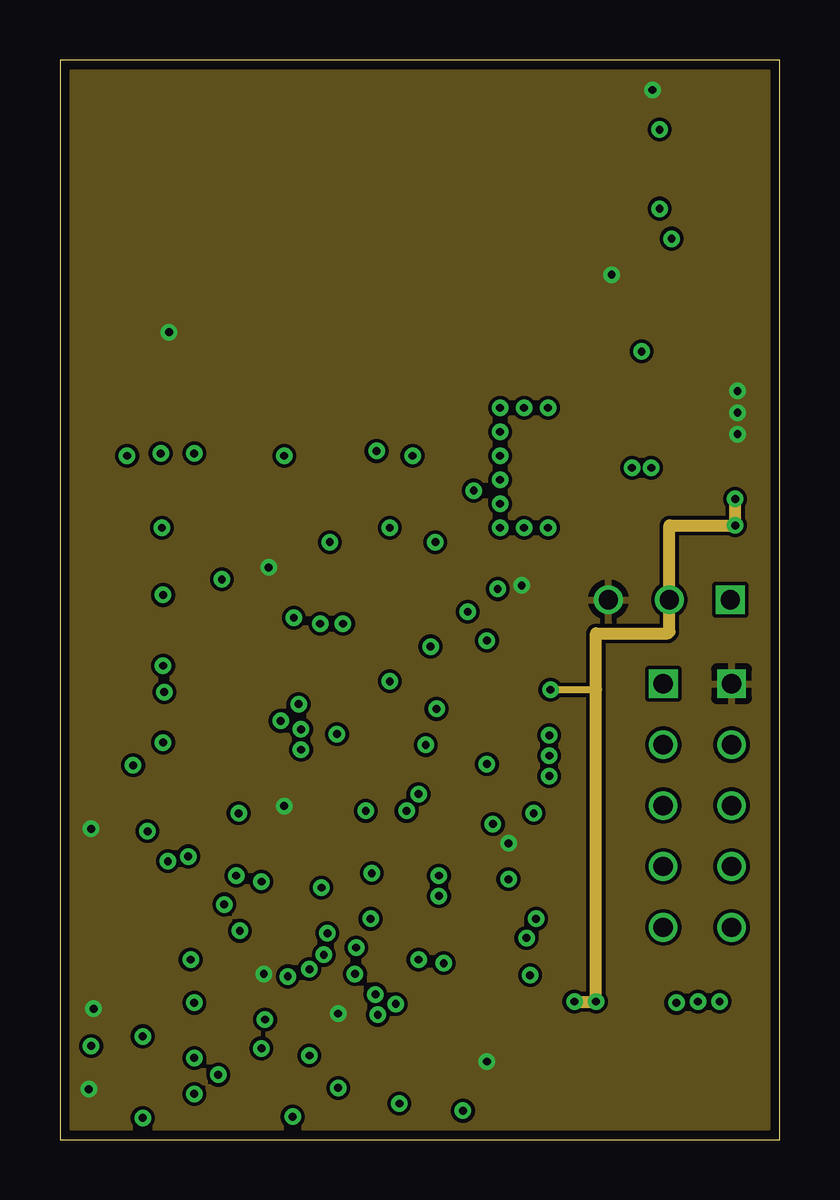
[diagram p10: board, inner layer Route3]
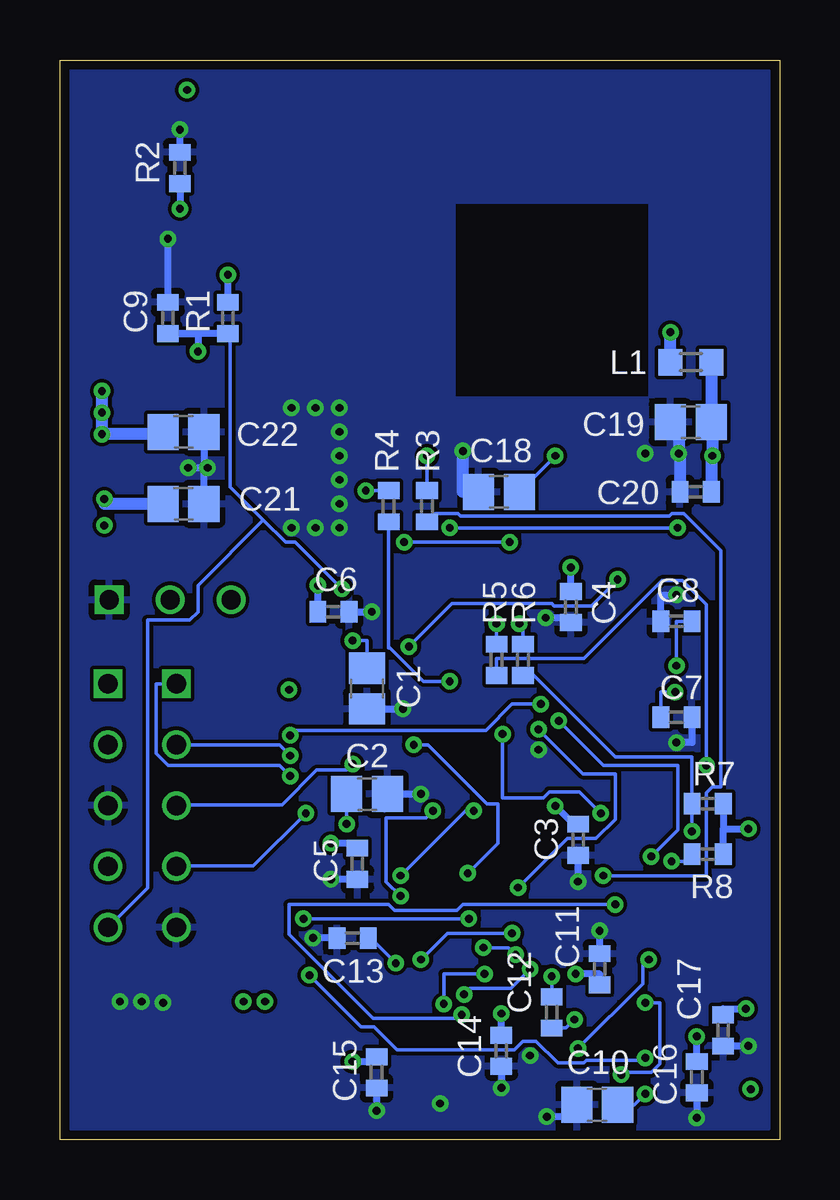
[diagram p11: board, bottom side, seen from below]

Size 30 x 45 mm. Coordinates in mm from the lower left corner, seen from the top.
Outline: 0,0 30,0 30,45 0,45 0,0
Copper layers (1*2*3*16): Top 0.0356mm / dielectric 0.5mm / Route2 0.0356mm / dielectric 0.5mm / Route3 0.0356mm / dielectric 0.5mm / Bottom 0.0356mm
Design rules: minimum track width 6mil, minimum drill 13mil, track to track 6mil, track to pad 6mil, pad to pad 6mil, via to via 6mil, smd to smd 6mil, copper to edge 15mil, drill to drill 6mil, minimum pad ring 7mil, minimum via ring 7mil, stop-mask expansion 4mil, vias tented up to drill 13mil, thermal gap 10mil

### Footprints (pad centres in the part's own frame; a part is rotated, then mirrored left to right if it is on the bottom)
OMROM_B3FS-1XXX = smd 1.6 x 1.4: P1 4,-2.25; P2 -4,-2.25; P3 4,2.25; P4 -4,2.25
C0805 = smd 1.3 x 1.5: 1 -0.85,0; 2 0.85,0
C0402 = smd 0.7 x 0.9: 1 -0.65,0; 2 0.65,0
R0603 = smd 1 x 1.1: 1 -0.85,0; 2 0.85,0
USB_MICRO_AB = smd 1.4 x 1.6: NC1 -0.9,3.2; NC6 -0.9,-3.2 | smd 1.3 x 2.3: NC2 -3.35,3.75; NC5 -3.35,-3.75 | smd 1.9 x 1.8: NC3 -3.35,1.15; NC4 -3.35,-1.15 | smd 1.35 x 0.4: P1 -0.675,1.3; P2 -0.675,0.65; P3 -0.675,0; P4 -0.675,-0.65; P5 -0.675,-1.3
ST_LINK = drill 0.8 square: P$1 0,0 | drill 0.8: P$2 0,2.54; P$3 0,5.08; P$4 0,7.62; P$5 0,10.16
PWR3 = drill 0.8 square: P$1 0,0 | drill 0.8: P$2 0,2.54; P$3 0,5.08
PINLIST5_2P54 = drill 0.8 square: P$1 0,0 | drill 0.8: P$2 0,2.54; P$3 0,5.08; P$4 0,7.62; P$5 0,10.16
R0402 = smd 0.7 x 0.9: 1 -0.65,0; 2 0.65,0
TQFP64 = smd 0.3 x 1.6: 1 -3.75,-5.6; 2 -3.25,-5.6; 3 -2.75,-5.6; 4 -2.25,-5.6; 5 -1.75,-5.6; 6 -1.25,-5.6; 7 -0.75,-5.6; 8 -0.25,-5.6; 9 0.25,-5.6; 10 0.75,-5.6; 11 1.25,-5.6; 12 1.75,-5.6; 13 2.25,-5.6; 14 2.75,-5.6; 15 3.25,-5.6; 16 3.75,-5.6; 33 3.75,5.6; 34 3.25,5.6; 35 2.75,5.6; 36 2.25,5.6; 37 1.75,5.6; 38 1.25,5.6; 39 0.75,5.6; 40 0.25,5.6; 41 -0.25,5.6; 42 -0.75,5.6; 43 -1.25,5.6; 44 -1.75,5.6; 45 -2.25,5.6; 46 -2.75,5.6; 47 -3.25,5.6; 48 -3.75,5.6 | smd 1.6 x 0.3: 17 5.6,-3.75; 18 5.6,-3.25; 19 5.6,-2.75; 20 5.6,-2.25; 21 5.6,-1.75; 22 5.6,-1.25; 23 5.6,-0.75; 24 5.6,-0.25; 25 5.6,0.25; 26 5.6,0.75; 27 5.6,1.25; 28 5.6,1.75; 29 5.6,2.25; 30 5.6,2.75; 31 5.6,3.25; 32 5.6,3.75; 49 -5.6,3.75; 50 -5.6,3.25; 51 -5.6,2.75; 52 -5.6,2.25; 53 -5.6,1.75; 54 -5.6,1.25; 55 -5.6,0.75; 56 -5.6,0.25; 57 -5.6,-0.25; 58 -5.6,-0.75; 59 -5.6,-1.25; 60 -5.6,-1.75; 61 -5.6,-2.25; 62 -5.6,-2.75; 63 -5.6,-3.25; 64 -5.6,-3.75
LGA_3X5X1_14L = smd 0.5 x 0.8: P1 -2,-1; P2 -1.2,-1; P3 -0.4,-1; P4 0.4,-1; P5 1.2,-1; P6 2,-1; P8 2,1; P9 1.2,1; P10 0.4,1; P11 -0.4,1; P12 -1.2,1; P13 -2,1 | smd 0.8 x 0.5: P7 2,0; P14 -2,0
LGA_4X5X1P1_28L = smd 0.4 x 0.3: P1 -2.263,1.25; P2 -2.263,0.75; P3 -2.263,0.25; P4 -2.263,-0.25; P5 -2.263,-0.75; P6 -2.263,-1.25; P15 2.263,-1.25; P16 2.263,-0.75; P17 2.263,-0.25; P18 2.263,0.25; P19 2.263,0.75; P20 2.263,1.25 | smd 0.3 x 0.4: P7 -1.75,-1.762; P8 -1.25,-1.762; P9 -0.75,-1.762; P10 -0.25,-1.762; P11 0.25,-1.762; P12 0.75,-1.762; P13 1.25,-1.762; P14 1.75,-1.762; P21 1.75,1.762; P22 1.25,1.762; P23 0.75,1.762; P24 0.25,1.762; P25 -0.25,1.762; P26 -0.75,1.762; P27 -1.25,1.762; P28 -1.75,1.762
LGA_3X5_8 = smd 0.55 x 1: P1 -1.875,-1.1; P2 -0.625,-1.1; P3 0.625,-1.1; P4 1.875,-1.1; P5 1.875,1.1; P6 0.625,1.1; P7 -0.625,1.1; P8 -1.875,1.1
MTK-3329 = smd 2 x 1: NC1 8,6.75; NC2 8,-6.75; P1 -8,6.75; P2 -8,5.25; P3 -8,3.75; P4 -8,2.25; P5 -8,0.75; P6 -8,-0.75; P7 -8,-2.25; P8 -8,-3.75; P9 -8,-5.25; P10 -8,-6.75
SOT223 = smd 1.219 x 2.235: 1 -2.311,-3.099; 2 0,-3.099; 3 2.311,-3.099 | smd 3.6 x 2.2: 4 0,3.099
XTAL_5X3P2 = smd 2.6 x 1.3: P$1 -2.2,-1.3; P$2 2.2,-1.3; P$3 2.2,1.3; P$4 -2.2,1.3

### Placement (x,y rotation side)
BOOT  24.5,41.5 180 top
C1  17.2,18.8 270 bottom
C2  17.2,14.4 0 bottom
C3  8.4,12.5 270 bottom
C4  8.7,22.2 270 bottom
C5  17.6,11.5 270 bottom
C6  18.6,22 0 bottom
C7  4.3,17.6 0 bottom
C8  4.3,21.6 180 bottom
C9  25.5,34.25 90 bottom
C10  7.6,1.45 180 bottom
C11  7.5,7.1 90 bottom
C12  9.5,5.3 90 bottom
C13  17.8,8.4 180 bottom
C14  11.6,3.7 270 bottom
C15  16.8,2.8 270 bottom
C16  3.45,2.6 270 bottom
C17  2.35,4.55 270 bottom
C18  11.7,27 180 bottom
C19  3.7,29.9 180 bottom
C20  3.5,27 180 bottom
C21  24.85,26.5 0 bottom
C22  24.85,29.5 0 bottom
L1  3.7,32.4 0 bottom
P1  24.4,4.8 90 top
P2  28,19 180 top
P3  27.95,22.5 90 top
P4  25.15,19 180 top
R1  23,34.25 90 bottom
R2  25,40.5 270 bottom
R3  14.7,26.4 270 bottom
R4  16.3,26.4 270 bottom
R5  11.8,20 270 bottom
R6  10.7,20 270 bottom
R7  3,14 0 bottom
R8  3,11.9 0 bottom
RST  24.5,35.25 180 top
U1  13.5,18 270 top
U2  8.5,3.9 270 top
U3  14.2,4.5 90 top
U4  3.5,4 270 top
U5  9.5,35 90 top
U6  23.35,28 90 top
XTAL1  4.3,19.6 270 top

### Tracks (layer width: path | path; a pad name or v marks a point on that pad's centre or on a via)
!RST  (via drill 0.33)
  Top 0.152: U1.7 10.95,18.75 10.95,16.65 11.3,16.3 14.35,16.3 14.35,20.3 15.2,21.15 17.3,21.15 17.3,21.45 18.25,22.4 v18.25,22.95
  Top 0.3: RST.P3 20.5,32.85 v24.25,32.85 28.5,32.85 RST.P4
  Bottom 0.152: v18.25,22.95 20.2,24.9 20.6,24.9 21.52,25.82 | 21.52,25.82 22.9,27.2 22.9,33.5 R1.1 | P2.P$5 26.35,10.5 26.35,21.65 24.6,21.65 24.25,22 24.25,23.1 21.52,25.82
  Bottom 0.3: R1.1 C9.1 24.25,33.6 v24.25,32.85
BOOT  (via drill 0.33)
  Top 0.152: U1.60 11.85,23.7 11.85,25.25 12.5,25.9 12.5,29.85 19.45,36.8 19.45,38.3 20.4,39.25 BOOT.P3
  Top 0.3: BOOT.P4 28.5,38.8 v25,38.8 20.5,38.8 BOOT.P3
  Bottom 0.3: R2.2 v25,38.8
DM
  Top 0.152: U1.44 22.9,19.75 22.9,6.75 23.75,6.75 P1.P2
DP
  Top 0.152: U1.45 23.35,20.25 23.35,7.2 24.4,7.2 24.4,4.15 P1.P3 24.4,4.1
GND  (via drill 0.33)
  Top 0.3: P1.P5 v25.7,5.7 25.7,5.75 v26.6,5.75 v27.5,5.75 27.5,3.95 27.6,3.95 P1.NC6 27.6,1.5 28.15,1.5 P1.NC5 P1.NC4 P1.NC3 P1.NC2 21.2,1.45 P1.NC1 | RST.P1 20.5,37.55 v25.5,37.55 25.5,37.5 RST.P2 | U6.4 20.25,25.5 v20.35,25.5 v19.35,25.5 | v19.35,25.5 v18.35,25.5 v18.35,26.5 | v18.35,26.5 v18.35,27.5 | v18.35,27.5 v18.35,28.5 | v18.35,28.5 v18.35,29.5 | v18.35,29.5 v18.35,30.5 v19.35,30.5 | v19.35,30.5 v20.35,30.5 20.35,28 | v19.35,25.5 19.35,26.5 v18.35,26.5 | v18.35,27.5 19.35,27.5 | v18.35,28.5 19.35,28.5 | v18.35,29.5 19.35,29.5 v19.35,30.5 | U5.P3 5.6,27 v5.6,28.6 | XTAL1.P$4 4.3,21.8 v4.3,22.7 | XTAL1.P$2 4.3,17.4 v4.3,16.55 | U1.63 10.25,21.75 v9.75,21.75 | U1.12 v10.05,16.25 | U1.18 10.25,10.75 v8.4,10.75 | U1.28 15.25,14.4 v14.95,14.4 | U3.P1 U3.P2 U3.P3 14.15,2.24 | 14.15,2.24 U3.P4 U3.P5 U3.P6 | 14.15,2.24 v14.15,1.5 | U2.P11 U2.P10 v10.4,3.5 | U2.P7 8.5,0.95 v9.7,0.95 | U4.P3 2.4,3.9 v1.3,3.9
  Top 0.5: U5.P8 13.2,27 v13.2,28.7
  Top 1: U6.2 v24.65,28 v23.85,28 20.35,28
  Bottom 0.3: R2.1 v25,42.1 | C9.2 v25.5,37.55 | C21.2 24,28 | C22.2 24,28 | 24,28 v23.85,28 v24.65,28 | C19.2 4.2,29.9 | C8.2 4.95,22.7 v4.3,22.7 | C7.2 3.65,16.55 v4.3,16.55 | C4.2 8.7,21.75 v9.75,21.75 | C3.2 v8.4,10.75 | C6.2 v17,22 | C1.2 v15.7,17.95 | C2.2 v14.95,14.4 | C5.2 v18.7,10.85 | C13.2 v19.45,8.4 | C11.2 v7.5,8.7 | C15.2 v16.8,1.2 | C14.2 v11.6,2.15 | C10.2 8.45,0.95 v9.7,0.95 | C17.2 v1.3,3.9 | C16.2 v3.45,0.9
  Bottom 0.5: C18.2 13.2,27 v13.2,28.7 | 4.2,29.9 v4.2,28.6 4.15,28.6 C20.2
  pour Route2: 0.5,0.5 0.5,44.5 29.5,44.5 29.5,0.5
  pour Top: 0.5,0.5 0.5,44.5 29.5,44.5 29.5,0.5
  pour Bottom: 0.5,0.5 0.5,44.5 29.5,44.5 29.5,0.5
GPS_3DFIX  (via drill 0.33)
  Top 0.152: U1.52 15.65,23.7 v15.65,24.9 | v11.25,24.9 8.75,24.9 U5.P5
  Bottom 0.152: v11.25,24.9 v15.65,24.9
GPS_ENABLE  (via drill 0.33)
  Top 0.152: U1.51 16.25,25.15 15.9,25.5 v13.75,25.5 | U5.P2 v4.25,25.5
  Bottom 0.152: v4.25,25.5 v13.75,25.5
GPS_RXD  (via drill 0.33)
  Top 0.152: v11.55,16.9 v13.75,19.1 | v7.45,13.6 7.9,14.05 U1.16
  Bottom 0.152: R4.2 16.3,20.5 16.25,20.5 14.85,19.1 v13.75,19.1 | v11.55,16.9 11.55,14.25 9.85,14.25 9.6,14.5 8.35,14.5 v7.45,13.6
GPS_TXD  (via drill 0.33)
  Top 0.152: v7.35,11 7.8,11 9.2,12.4 U1.17
  Bottom 0.152: R3.2 14.35,26.1 13.4,26.1 13.3,26 4.6,26 4.5,26.1 4,26.1 2.45,24.55 2.45,14.7 2.8,14.7 3.05,14.45 3.05,11 v7.35,11
I2C_SCL  (via drill 0.33)
  Top 0.152: U2.P2 5.25,5.1 5.25,5.2 4.6,5.85 U4.P8 4.6,11.5 v4.5,11.6 4.45,11.65 4.45,14.2 v3.05,15.6
  Bottom 0.152: R8.1 3.95,11.6 v4.5,11.6 | R5.2 11.8,20.05 8.15,20.05 4.9,23.3 4.05,23.3 3.05,22.3 v3.05,15.6
I2C_SDA  (via drill 0.33)
  Top 0.152: U2.P3 4.6,4.3 U4.P7 4.6,4.7 3.65,5.65 v3.65,12.85
  Bottom 0.152: R6.2 10.25,19.35 6.85,15.95 3.65,15.95 R7.1 v3.65,12.85
LSM303_DRDY  (via drill 0.33)
  Top 0.152: U2.P9 11,2.7 11,1.9 12.35,0.55 19,0.55 19,7.1 21,9.1 21,16.25 v20.4,16.85 | v9.95,18.15 7.9,18.15 U1.8
  Bottom 0.152: v20.4,16.85 20.2,17.05 12.25,17.05 11.15,18.15 v9.95,18.15
LSM303_INT1  (via drill 0.33)
  Top 0.152: v6.6,2.7 U2.P5 | v5.6,5.7 6.05,6.15 6.05,15.55 6.85,16.35 6.85,17.5 7.1,17.75 U1.9
  Bottom 0.152: v6.6,2.7 6.5,2.8 5.35,2.8 5,3.15 5,5.7 v5.6,5.7
LSM303_INT2  (via drill 0.33)
  Top 0.152: U2.P4 8.4,3.5 v8.4,3.8 | v5.45,7.5 5.35,7.6 v5.35,11.8 | v9.2,17.45 8.9,17.45 8.7,17.25 U1.10
  Bottom 0.152: v8.4,3.8 5.7,6.5 5.7,7.5 v5.45,7.5 | v5.35,11.8 4.25,12.9 4.25,15.6 7.35,15.6 v9.2,17.45
LSM330_DEN_GYRO  (via drill 0.33)
  Top 0.152: v14.95,7.5 U3.P16 | v11.15,8.6 10.9,8.85 v10.9,10.5 | v10.05,17.1 9.7,17.1 9.35,16.75 U1.11
  Bottom 0.152: v14.95,7.5 13.85,8.6 v11.15,8.6 | v10.9,10.5 8.85,12.55 7.65,12.55 6.85,13.35 6.85,15.25 8.2,15.25 v10.05,17.1
LSM330_DRDY_GYRO  (via drill 0.33)
  Top 0.152: v15.8,10.15 14.35,8.7 14.35,6.9 14.45,6.8 U3.P17 | v14.45,13.7 13.35,13.7 13.35,12.5 U1.24
  Bottom 0.152: v15.8,10.15 16.4,10.75 16.4,13.4 14.75,13.4 v14.45,13.7
LSM330_INT1_ACCL  (via drill 0.33)
  Top 0.152: v12.95,9.2 U3.P20 | v19.85,9.2 19.3,9.75 19.3,12.75 17.2,14.85 17.2,15.9 17.55,16.25 U1.37
  Bottom 0.152: v19.85,9.2 v12.95,9.2
LSM330_INT1_GYRO
  Top 0.152: U1.25 13.75,11.6 13.9,11.45 13.9,6.85 13.95,6.8 U3.P18
LSM330_INT2_ACCL  (via drill 0.33)
  Top 0.152: v13,11.1 13.55,10.55 13.55,6.9 13.45,6.8 U3.P19 | v15.25,16.45 17.3,16.45 17.6,16.75 U1.38
  Bottom 0.152: v13,11.1 11.75,12.35 11.75,14 12.2,14 14.65,16.45 v15.25,16.45
MPL311_P_INT1  (via drill 0.33)
  Top 0.152: v5.6,3.4 4.6,3.4 U4.P6 | v19.6,6.85 21.35,8.6 21.35,16.75 20.65,17.45 20.1,17.45 19.9,17.25 U1.39
  Bottom 0.152: v5.6,3.4 5.7,3.3 8.05,3.3 8.15,3.2 9.25,3.2 10.15,4.1 10.7,4.1 11.05,3.75 15.95,3.75 16.9,4.7 17.45,4.7 v19.6,6.85
MPL311_P_INT2  (via drill 0.33)
  Top 0.152: v6.75,23.35 2.25,23.35 0.7,21.8 0.7,2.85 2.8,2.85 3.15,2.5 3.15,2.15 4.6,2.15 U4.P5 | v15.45,20.55 18.25,17.75 U1.40
  Bottom 0.152: v6.75,23.35 7.85,22.25 9.4,22.25 9.5,22.35 13.65,22.35 v15.45,20.55
N$1  (via drill 0.33)
  Top 0.152: v18.05,13.15 17.65,13.55 16.75,13.55 U1.31
  Bottom 0.152: v18.05,13.15 C2.1
N$2  (via drill 0.33)
  Top 0.152: v17.8,20.8 18.25,21.25 U1.47
  Bottom 0.152: C1.1 17.2,20.8 v17.8,20.8
N$3  (via drill 0.33)
  Top 0.152: U2.P12 8.55,5.1 v8.55,5
  Bottom 0.152: v8.55,5 8.9,4.65 C12.1
N$4  (via drill 0.33)
  Top 0.152: XTAL1.P$1 3,19.75 v4.3,19.75 U1.5
  Bottom 0.152: C8.1 4.3,21.6 v4.3,19.75
N$5  (via drill 0.33)
  Top 0.152: v9.5,6.8 U2.P13
  Bottom 0.152: C12.2 v9.5,6.8
N$6  (via drill 0.33)
  Top 0.152: U1.6 5.6,19.25 5.6,18.65 | 5.6,18.65 XTAL1.P$3 | 5.6,18.65 v4.35,18.65
  Bottom 0.152: C7.1 4.95,18.65 v4.35,18.65
N$9  (via drill 0.33)
  Top 0.152: v5.6,1.9 U2.P6
  Bottom 0.152: v5.6,1.9 6.05,1.45 C10.1
N$10  (via drill 0.33)
  Top 0.152: v16,7.35 15.45,6.8 U3.P15
  Bottom 0.152: v16,7.35 17.05,8.4 C13.1
N$11  (via drill 0.33)
  Top 0.3: U4.P2 3.45,4.62 v3.45,4.3
  Bottom 0.3: C16.1 v3.45,4.3
N$14  (via drill 0.33)
  Top 0.152: v14.7,28.5 14.75,28.45 U5.P9
  Bottom 0.152: v14.7,28.5 R3.1
N$15  (via drill 0.33)
  Top 0.152: v17.25,27.05 16.25,27.05 U5.P10
  Bottom 0.152: v17.25,27.05 R4.1
N$18  (via drill 0.33)
  Top 0.152: v9.35,28.5 7.25,28.5 U5.P4
  Bottom 0.152: v9.35,28.5 C18.1
PB8  (via drill 0.33)
  Top 0.152: v11.8,21.5 11.25,22.05 U1.61
  Bottom 0.152: v11.8,21.5 R5.1
PB9  (via drill 0.33)
  Top 0.152: v10.85,21.5 10.75,21.6 U1.62
  Bottom 0.152: R6.1 10.7,21.5 v10.85,21.5
SPI_CLK  (via drill 0.33)
  Top 0.152: U3.P24 12.85,4.75 13,4.6 14,4.6 v14,5.65 | v12.3,6.9 11.75,7.45 U1.21
  Bottom 0.152: v14,5.65 14,6.9 v12.3,6.9
SPI_CS_ACCL  (via drill 0.33)
  Top 0.152: U3.P23 13.25,5.25 v13.25,5.2 | v6.85,9.8 6.4,10.25 6.4,14.55 7.1,15.25 U1.14
  Bottom 0.152: v13.25,5.2 13.4,5.05 16.95,5.05 20.45,8.55 20.45,9.8 16.3,9.8 16.05,9.55 13.45,9.55 13.2,9.8 v6.85,9.8
SPI_CS_GYRO  (via drill 0.33)
  Top 0.152: U3.P22 12.95,5.75 12.95,5.85 v13.15,6.05 | v10.4,7.1 6.75,10.75 6.75,14.4 7.1,14.75 U1.15
  Bottom 0.152: v13.15,6.05 12.9,6.3 11.2,6.3 v10.4,7.1
SPI_MISO  (via drill 0.33)
  Top 0.152: U3.P27 U3.P26 12.4,3.8 11,3.8 v11,7.7 | v12.35,8 12.25,8.1 U1.22
  Bottom 0.152: v11,7.7 11.3,8 v12.35,8
SPI_MOSI  (via drill 0.33)
  Top 0.152: v15.8,11 18.4,8.4 18.4,2.65 17.4,2.65 16.2,1.45 16.2,0.9 13.6,0.9 12.55,1.95 12.55,2.65 U3.P28 | U1.23 v12.75,13.7
  Bottom 0.152: v15.8,11 13.1,13.7 v12.75,13.7
SPIEXT_CLK  (via drill 0.33)
  Top 0.152: U1.34 20.4,14.75 v20.4,15.15
  Bottom 0.152: v20.4,15.15 20.85,15.6 25.5,15.6 26,16.1 26,19 P4.P$1
SPIEXT_MISO  (via drill 0.33)
  Top 0.152: U1.35 17.8,15.25 v17.8,15.65
  Bottom 0.152: v17.8,15.65 18.05,15.4 19.3,15.4 20.75,13.95 25.15,13.95 P4.P$3
SPIEXT_MOSI  (via drill 0.33)
  Top 0.152: U1.36 20.4,15.75 v20.4,16
  Bottom 0.152: v20.4,16 20.85,16.45 P4.P$2
SPIEXT_NSS  (via drill 0.33)
  Top 0.152: v19.75,13.6 U1.33
  Bottom 0.152: v19.75,13.6 21.95,11.4 25.15,11.4 P4.P$4
SWCLK
  Top 0.152: U1.49 18.9,23.6 19,23.7 24.2,23.7 24.25,23.75 24.25,21.45 27.15,18.55 27.15,17.35 28,16.5 P2.P$2
SWDIO
  Top 0.152: U1.46 24.3,20.75 24.3,15.95 28,12.25 P2.P$4
VDD  (via drill 0.33)
  Top 0.3: BOOT.P1 v24.7,43.75 BOOT.P2 | U1.64 9.75,23.85 v8.7,23.85 7.9,23.85 U1.1 | U1.19 10.75,13.9 v9.35,13.9 9.35,15.75 U1.13 | U1.48 19.25,21.75 v19.25,23.1 | U1.32 17.25,12.35 v18.7,12.35 | U3.P8 v17.8,3.25 | U3.P8 U3.P7 | U3.P8 U3.P9 U3.P10 U3.P11 U3.P12 U3.P13 U3.P14 | U3.P25 11.6,4.25 v11.6,5.25 11.6,6.25 U3.P21 | v8.5,6.9 U2.P14 U2.P1 | U4.P1 2.4,5.45 v1.4,5.45 | U4.P4 2.4,2.1 v1.2,2.1
  Top 0.5: U6.3 v28.25,30.3 v28.25,29.4 v28.25,31.2
  Bottom 0.3: R1.2 v23,36.05 | C4.1 v8.7,23.85 | C3.1 8.6,13.15 v9.35,13.9 | R7.2 2.35,12.95 | 2.35,12.95 v1.3,12.95 | R8.2 2.35,12.95 | C6.1 v19.25,23.1 | C5.1 17.6,12.35 v18.7,12.35 | C15.1 16.8,3.25 v17.8,3.25 | C14.1 v11.6,5.25 | C11.1 7.5,6.9 v8.5,6.9 | C17.1 2.35,5.45 v1.4,5.45
  Bottom 0.5: C22.1 25.7,29.4 v28.25,29.4 28.25,31.3 | L1.1 v4.55,33.65
  pour Route3: 0.5,0.5 0.5,44.5 29.5,44.5 29.5,0.5
VDD_5  (via drill 0.33)
  Top 0.3: U1.42 v20.45,18.75
  Top 0.4: P1.P1 23.1,5.75 v22.35,5.75 v21.45,5.75
  Top 0.5: 28.15,25.69 v28.15,25.6 | U6.1 28.15,25.69 | 28.15,25.69 v28.15,26.7
  Route3 0.3: 22.35,18.75 v20.45,18.75
  Route3 0.4: v22.35,5.75 22.4,5.75
  Route3 0.5: v28.15,26.7 v28.15,25.6 25.41,25.6 P3.P$2 25.41,21.16 25.35,21.1 22.35,21.1 22.35,18.75 v22.35,5.75 v21.45,5.75
  Bottom 0.5: C21.1 28.15,26.5 v28.15,26.7
VDD_GPS  (via drill 0.33)
  Top 0.5: U5.P1 2.8,27 v2.8,28.5
  Bottom 0.5: L1.2 C19.1 2.8,29.9 v2.8,28.5 2.85,28.5 C20.1

### Text on the board
bDocu: IMU_NoPilot | (c) 2012 Kjell H Andersen | http://www.lentic.net | http://code.google.com/p/nopilot/ | No Pilot ??